# Altium project nova34.PrjPcb (part 2 of 3)

## Sheet Page09 WIFI&Bluetooth.SchDoc
size 386 x 246 mm; SheetNumber: 7; SheetTotal: 11
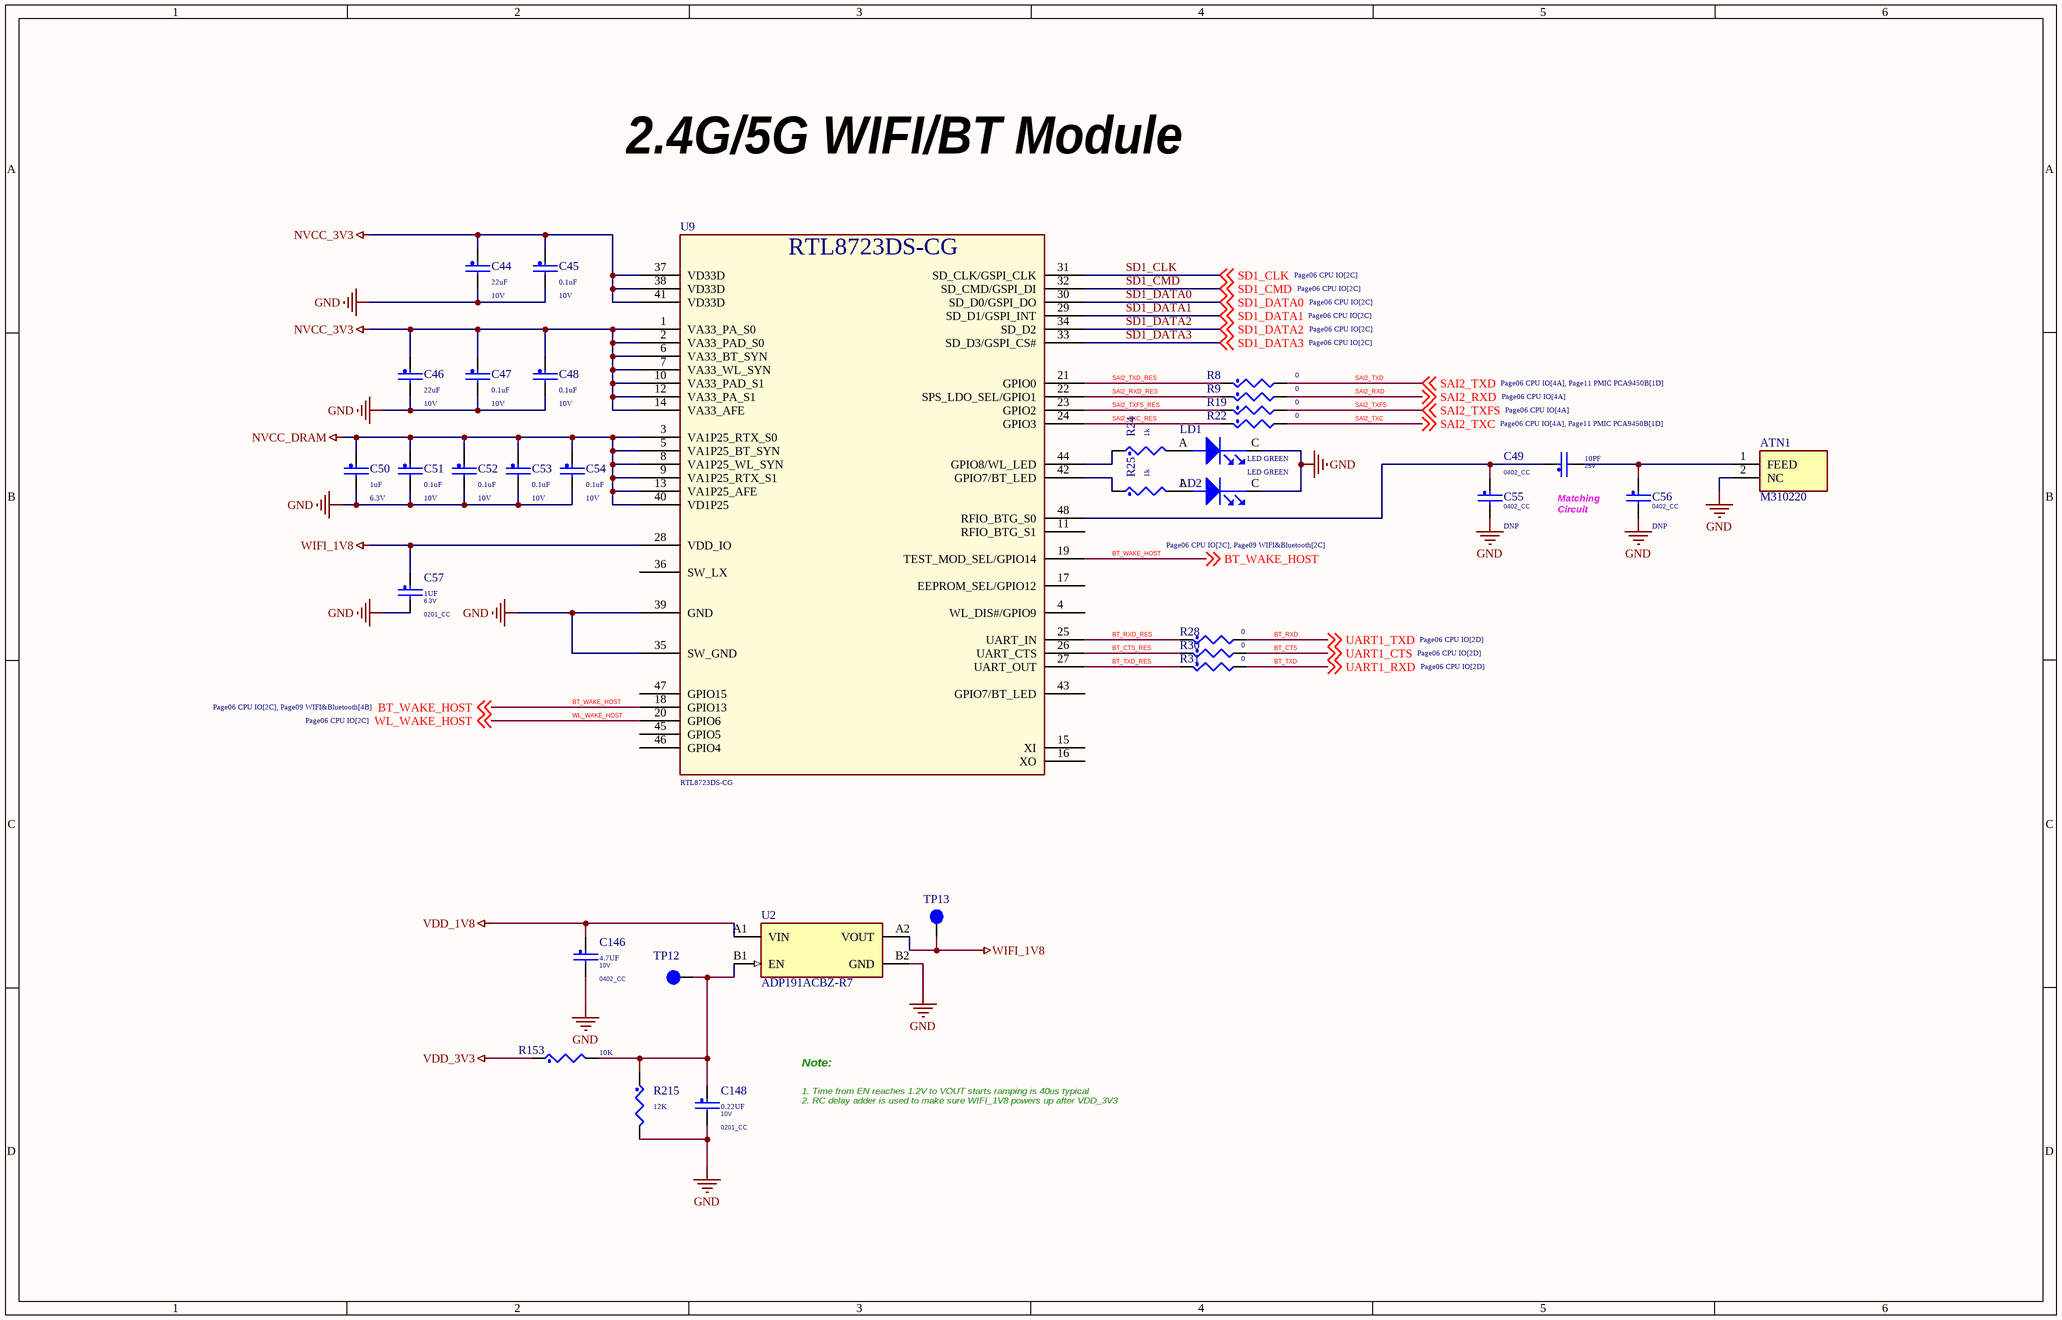
[diagram p7: Page09 WIFI&Bluetooth.SchDoc]

### Parts
ATN1  M310220  [M310220]
C44  22uF  Voltage: 10V  [0603_CC]
C45  0.1uF  Voltage: 10V  [0201_CC - C]
C46  22uF  Voltage: 10V  [0603_CC]
C47  0.1uF  Voltage: 10V  [0201_CC - C]
C48  0.1uF  Voltage: 10V  [0201_CC - C]
C49  10PF  VOLTAGE: 25V  PCB Footprint: 0402_CC  [0402_CC - C]
C50  1uF  Voltage: 6.3V  [0201_CC - C]
C51  0.1uF  Voltage: 10V  [0201_CC - C]
C52  0.1uF  Voltage: 10V  [0201_CC - C]
C53  0.1uF  Voltage: 10V  [0201_CC - C]
C54  0.1uF  Voltage: 10V  [0201_CC - C]
C55  ASSY_OPT: DNP  PCB Footprint: 0402_CC  [0402_CC - C]  (hidden comment: 10PF)
C56  ASSY_OPT: DNP  PCB Footprint: 0402_CC  [0402_CC - C]  (hidden comment: 10PF)
C57  1UF  PCB Footprint: 0201_CC  VOLTAGE: 6.3V  [0201_CC - C]
C146  4.7UF  PCB Footprint: 0402_CC  VOLTAGE: 10V  [0402_CC - C]
C148  0.22UF  VOLTAGE: 10V  PCB Footprint: 0201_CC  [0201_CC - C]
LD1  LED GREEN  [LED_0603]
LD2  LED GREEN  [LED_0603]
R8  0  [0402_CC_RES]
R9  0  [0402_CC_RES]
R19  0  [0402_CC_RES]
R22  0  [0402_CC_RES]
R24  1k  [0201_RES]
R25  1k  [0201_RES]
R28  0  [0402_CC_RES]
R30  0  [0402_CC_RES]
R31  0  [0402_CC_RES]
R153  10K  [0201_RES]
R215  12K  [0201_RES]
TP12  tpad_020  [Test Pin]  (value not drawn)
TP13  tpad_020  [Test Pin]  (value not drawn)
U2  ADP191ACBZ-R7  [FP-CB-4-3-MFG]
U9  RTL8723DS-CG  [RTL8723DS-CG]

### Nets
GND: ATN1.2(NC) C44.2 C45.2 C46.2 C47.2 C48.2 C50.2 C51.2 C52.2 C53.2 C54.2 C55.2 C56.2 C57.2 C146.2 C148.2 LD1.C(CATHODE) LD2.C(CATHODE) R215.2 U2.B2(GND) U9.35(SW_GND) U9.39(GND)
NVCC_DRAM: C50.1 C51.1 C52.1 C53.1 C54.1 U9.3(VA1P25_RTX_S0) U9.5(VA1P25_BT_SYN) U9.8(VA1P25_WL_SYN) U9.9(VA1P25_RTX_S1) U9.13(VA1P25_AFE) U9.40(VD1P25)
VDD_1V8: C146.1 U2.A1(VIN)
VDD_3V3: C44.1 C45.1 C46.1 C47.1 C48.1 R153.1 U9.1(VA33_PA_S0) U9.2(VA33_PAD_S0) U9.6(VA33_BT_SYN) U9.7(VA33_WL_SYN) U9.10(VA33_PAD_S1) U9.12(VA33_PA_S1) U9.14(VA33_AFE) U9.37(VD33D) U9.38(VD33D) U9.41(VD33D)  [also labelled NVCC_3V3]
WIFI_1V8: C57.1 TP13.1(Pin1) U2.A2(VOUT) U9.28(VDD_IO)
BT_CTS: R30.2 ; off-sheet UART1_CTS  [also labelled UART1_CTS]
BT_CTS_RES: R30.1 U9.26(UART_CTS)
BT_RXD: R28.2 ; off-sheet UART1_TXD  [also labelled UART1_TXD]
BT_RXD_RES: R28.1 U9.25(UART_IN)
BT_TXD: R31.2 ; off-sheet UART1_RXD  [also labelled UART1_RXD]
BT_TXD_RES: R31.1 U9.27(UART_OUT)
BT_WAKE_HOST: U9.18(GPIO13) U9.19(TEST_MOD_SEL/GPIO14) ; off-sheet BT_WAKE_HOST
SAI2_RXD: R9.2 ; off-sheet SAI2_RXD
SAI2_RXD_RES: R9.1 U9.22(SPS_LDO_SEL/GPIO1)
SAI2_TXC: R22.2 ; off-sheet SAI2_TXC
SAI2_TXC_RES: R22.1 U9.24(GPIO3)
SAI2_TXD: R8.2 ; off-sheet SAI2_TXD
SAI2_TXD_RES: R8.1 U9.21(GPIO0)
SAI2_TXFS: R19.2 ; off-sheet SAI2_TXFS
SAI2_TXFS_RES: R19.1 U9.23(GPIO2)
SD1_CLK: U9.31(SD_CLK/GSPI_CLK) ; off-sheet SD1_CLK
SD1_CMD: U9.32(SD_CMD/GSPI_DI) ; off-sheet SD1_CMD
SD1_DATA0: U9.30(SD_D0/GSPI_DO) ; off-sheet SD1_DATA0
SD1_DATA1: U9.29(SD_D1/GSPI_INT) ; off-sheet SD1_DATA1
SD1_DATA2: U9.34(SD_D2) ; off-sheet SD1_DATA2
SD1_DATA3: U9.33(SD_D3/GSPI_CS#) ; off-sheet SD1_DATA3
WL_WAKE_HOST: U9.20(GPIO6) ; off-sheet WL_WAKE_HOST
NetATN1_1: ATN1.1(FEED) C49.2 C56.1
NetC49_1: C49.1 C55.1 U9.48(RFIO_BTG_S0)
NetC148_1: C148.1 R153.2 R215.1 TP12.1(Pin1) U2.B1(EN)
NetLD1_A: LD1.A(ANODE) R24.2
NetLD2_A: LD2.A(ANODE) R25.2
NetR24_1: R24.1 U9.44(GPIO8/WL_LED)
NetR25_1: R25.1 U9.42(GPIO7/BT_LED)

Not connected (* = marked no-connect by the designer): U9 4(WL_DIS#/GPIO9) 11(RFIO_BTG_S1) 15(XI) 16(XO) 17(EEPROM_SEL/GPIO12) 36(SW_LX) 43(GPIO7/BT_LED) 45(GPIO5) 46(GPIO4) 47(GPIO15)

### Notes on the sheet
- 2.4G/5G WIFI/BT Module
- (near C56) Matching
  Circuit
- Note:
- 1. Time from EN reaches 1.2V to VOUT starts ramping is 40us typical
  2. RC delay adder is used to make sure WIFI_1V8 powers up after VDD_3V3

### Library data of the parts
ATN1 = M310220: Antennas Ceramic Chip ANTENNA BT/WLAN 2.4-2.5GHz; Manufacturer_Name: Kyocera AVX; Geometry.Height: 1.18mm; Farnell Part Number: *; Farnell Price/Stock: *; Manufacturer_Part_Number: M310220; Datasheet Link: *
C44-C48 C50-C54 = CAP_NP: CLASS: DISCRETE
C49 C56 = CAP_NP: CAP CER 10PF 25V 5% C0G 0402; CLASS: DISCRETE; MFG_PN01: C0402C0G250-100JNP; MFG_NAME01: VENKEL COMPANY; CAD_APPROVED: Yes; FPLIST: CC0402_25,CC0402_HD,0402_CC; AGILE_PN: 150-30134; ROHS: Yes; Tolerance: 5%; Package Type: 0402; HEIGHT: 0.635 MM; Package Size: Paper Tape (7" Reel)
  C56: VOLTAGE: 25V
C55 = CAP_NP: CAP CER 10PF 25V 5% C0G 0402; CLASS: DISCRETE; AGILE_PN: 150-30134; FPLIST: CC0402_25,CC0402_HD,0402_CC; CAD_APPROVED: Yes; MFG_NAME01: VENKEL COMPANY; MFG_PN01: C0402C0G250-100JNP; Package Size: Paper Tape (7" Reel); HEIGHT: 0.635 MM; Package Type: 0402; Tolerance: 5%; ROHS: Yes; VOLTAGE: 25V
C57 = CAP_NP: as C90 on sheet Page04 CPU PWR; Package Type: 7¡± reel; Package Size: 0201; HEIGHT: 0.35MM; ROHS: Yes; Tolerance: 20%
C146 = CAP_NP: as C260 on sheet Page04 CPU PWR; Tolerance: 10%; ROHS: Yes; HEIGHT: 0.65MM
C148 = CAP_NP: CAP CER 0.22UF 10V 20% X5R 0201; CLASS: DISCRETE; FPLIST: CC0201,CC0201_HD,0201_CC; CAD_APPROVED: Yes; MFG_PN01: LMK063BJ224MP-F; MFG_NAME01: Taiyo Yuden; AGILE_PN: 150-78815; HEIGHT: 0.33MM; ROHS: Yes; Tolerance: 20%
LD1 LD2 = LED: as D1 on sheet Page06 CPU IO; ROHS: Yes; HEIGHT: 0.8 MM; PCB Footprint: LED_0603
R8 R9 R19 R22 = RES: RES MF ZERO OHM 1/16W 5% 0402; CLASS: DISCRETE; PCB Footprint: 0402_CC; AGILE_PN: 470-75394; MFG_NAME01: YAGEO AMERICA; MFG_PN01: RC0402JR-070RL; CAD_APPROVED: Yes; FPLIST: RC0402_25,RC0402_HD,RC0402_X2,0402_CC; TOL: 1%; SIGNAL_MODEL: DEFAULT_RESISTOR_10000OHM_2_1; VOLTAGE: 1/16W; Tolerance: 5%; ROHS: Yes; HEIGHT: 0.45 MM
R24 R25 = RES: RES MF 1.0K OHM 1/20W 1% 30V -55+155C 0201; CLASS: DISCRETE; Temp Range: -55¡ãC ~ 155¡ãC; VOLTAGE: 30; FPLIST: RC0201,0201_CC; CAD_APPROVED: Yes; MFG_PN01: CRCW02011K00FNED; MFG_NAME01: VISHAY INTERTECHNOLOGY; AGILE_PN: 470-82221; PCB Footprint: 0201_CC; HEIGHT: 0.28MM; Temp_Range: -55¡ãC ~ 155¡ãC; ROHS: Yes; Tolerance: 1%
R28 R30 R31 = RES: RES MF ZERO OHM 1/16W 5% 0402; CLASS: DISCRETE; AGILE_PN: 470-75394; MFG_NAME01: YAGEO AMERICA; MFG_PN01: RC0402JR-070RL; CAD_APPROVED: Yes; FPLIST: RC0402_25,RC0402_HD,RC0402_X2,0402_CC; TOL: 1%; SIGNAL_MODEL: DEFAULT_RESISTOR_10000OHM_2_1; PCB Footprint: 0402_CC; VOLTAGE: 1/16W; Tolerance: 5%; ROHS: Yes; HEIGHT: 0.45 MM
R153 = RES: RES MF 10K 1/20W 5% 0201; CLASS: DISCRETE; FPLIST: RC0201,0201_CC; CAD_APPROVED: Yes; MFG_PN01: RTT01103JTH; MFG_NAME01: RALEC ELECTRONIC CORP; AGILE_PN: 470-79719; PCB Footprint: 0201_CC; HEIGHT: 0.26 MM; ROHS: Yes; Tolerance: 5%
R215 = RES: RES MF 12K 1/20W 1% 0201; CLASS: DISCRETE; PCB Footprint: 0201_CC; MFG_PN01: RC-0201-123FT; MFG_NAME01: SKYMOS; CAD_APPROVED: Yes; FPLIST: RC0201,0201_CC; AGILE_PN: 470-77701; VOLTAGE: 1/20W; ROHS: Yes; Tolerance: 1%; HEIGHT: 0.26MM
TP12 TP13 = TESTLOOP: TEST POINT PAD 0.5MM DIA SMT, NO PART TO ORDER; CLASS: IO; CAD_APPROVED: Yes; AGILE_PN: 211-77484; PCB Footprint: tpad_020; HEIGHT: 0.1MM; ROHS: Yes
U2 = CMP-09138-000080-1: IC PWR SWITCH P-CHAN 1:1 4WLCSP; Nominal Supply Current: 500mA; Output Configuration: High Side; Max Power Dissipation: 7.2uW; Min Input Voltage: 1.1V; Operating Supply Current: 2uA; On-State Resistance: 105mR; Max Input Voltage: 3.6V; Number of Outputs: 1; Interface: On/Off; Lead Free: Contains Lead; RoHS Compliant: Yes; Number of Pins: 4; Output Current: 500mA; Min Operating Temperature: -40°C; Mount: Surface Mount; Supply Current: 500mA; Package Quantity: 1; Radiation Hardening: No; Max Output Current: 500mA; Max Supply Current: 500mA; REACH SVHC: No SVHC; Max Operating Temperature: 85°C; Packaging: Tape and Reel; Series: -; Operating Supply Voltage: 3.6V

## Sheet Page10 BOOT_CFG.SchDoc
size 513 x 386 mm; SheetNumber: 8; SheetTotal: 11
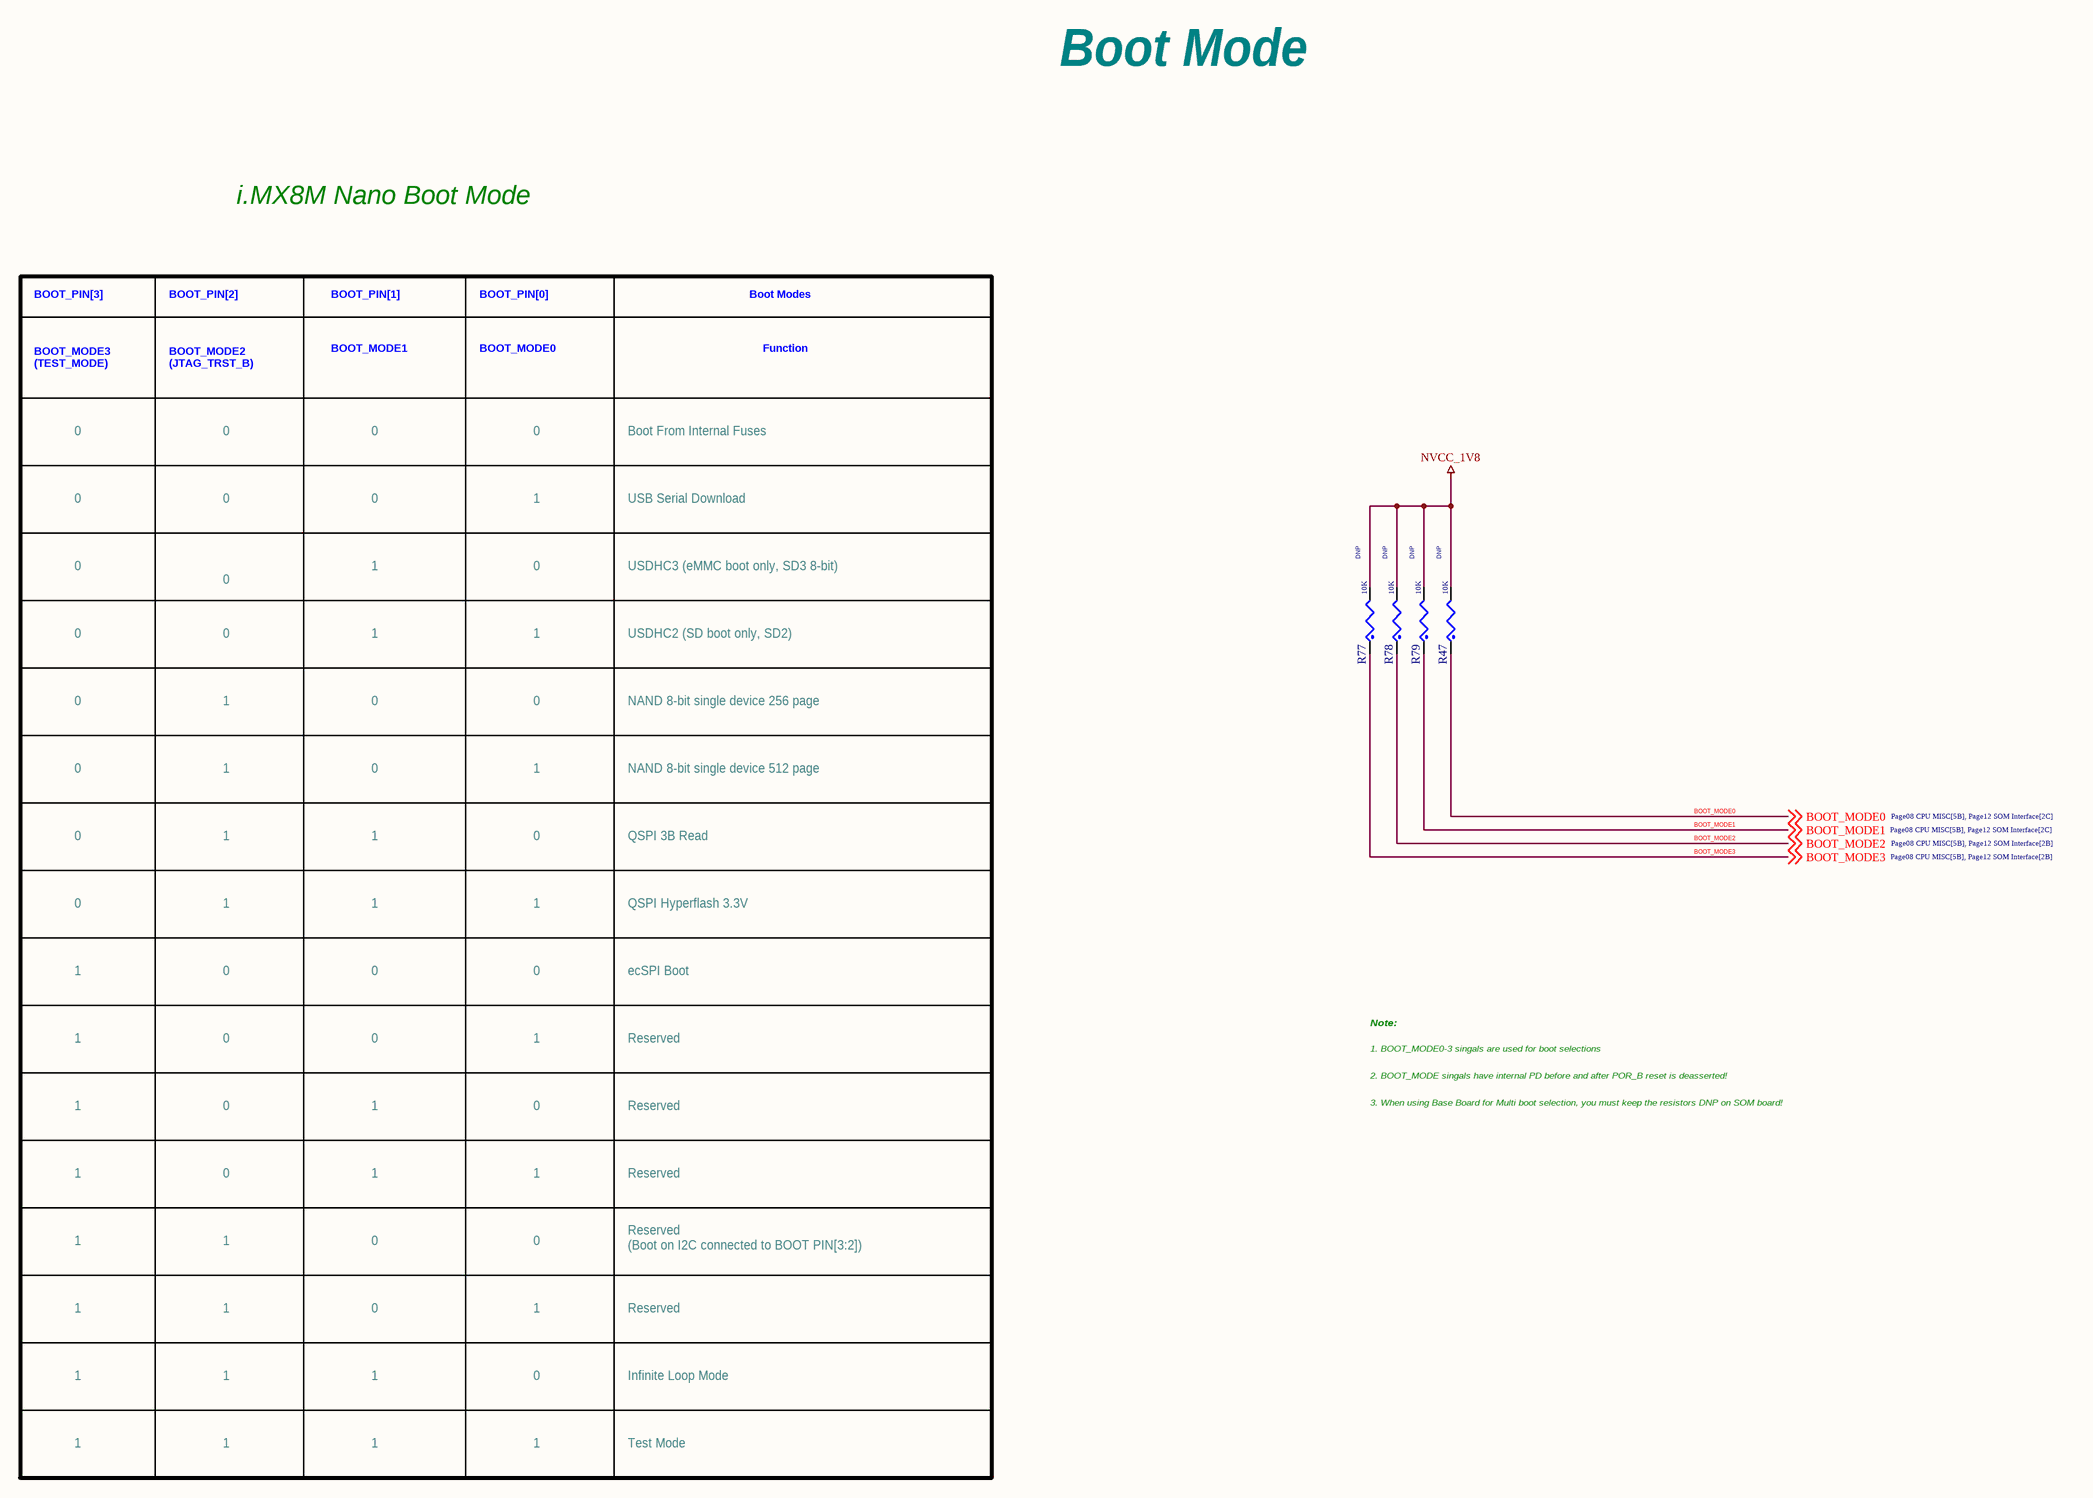
[diagram p8: Page10 BOOT_CFG.SchDoc]

### Parts
R47  10K  ASSY_OPT: DNP  [0402_CC_RES]
R77  10K  ASSY_OPT: DNP  [0402_CC_RES]
R78  10K  ASSY_OPT: DNP  [0402_CC_RES]
R79  10K  ASSY_OPT: DNP  [0402_CC_RES]

### Nets
NVCC_1V8: R47.2 R77.2 R78.2 R79.2  [project net VDD_1V8]
BOOT_MODE0: R47.1 ; off-sheet BOOT_MODE0
BOOT_MODE1: R79.1 ; off-sheet BOOT_MODE1
BOOT_MODE2: R78.1 ; off-sheet BOOT_MODE2
BOOT_MODE3: R77.1 ; off-sheet BOOT_MODE3

### Notes on the sheet
- Boot Mode
- i.MX8M Nano Boot Mode
- BOOT_PIN[3]
- BOOT_PIN[2]
- BOOT_PIN[1]
- BOOT_PIN[0]
- Boot Modes
- BOOT_MODE1
- BOOT_MODE0
- Function
- BOOT_MODE3
  (TEST_MODE)
- 0
- BOOT_MODE2
  (JTAG_TRST_B)
- Boot From Internal Fuses
- 1
- USB Serial Download
- USDHC3 (eMMC boot only, SD3 8-bit)
- USDHC2 (SD boot only, SD2)
- NAND 8-bit single device 256 page
- NAND 8-bit single device 512 page
- QSPI 3B Read
- QSPI Hyperflash 3.3V
- ecSPI Boot
- Reserved
- Note:
- 3. When using Base Board for Multi boot selection, you must keep the resistors DNP on SOM board!
- 2. BOOT_MODE singals have internal PD before and after POR_B reset is deasserted!
- 1. BOOT_MODE0-3 singals are used for boot selections
- Reserved
  (Boot on I2C connected to BOOT PIN[3:2])
- Infinite Loop Mode
- Test Mode

### Library data of the parts
R47 R77 = RES: RES MF 10K 1/16W 5% 0402; CLASS: DISCRETE; PCB Footprint: 0402_CC; AGILE_PN: 470-75557; MFG_NAME01: VISHAY INTERTECHNOLOGY; MFG_PN01: CRCW040210K0JNED; CAD_APPROVED: Yes; FPLIST: RC0402_25,RC0402_HD,0402_CC; HEIGHT: 0.4 MM; TOL: 5%; Tolerance: 5%; ROHS: Yes
R78 R79 = RES: RES MF 10K 1/16W 5% 0402; CLASS: DISCRETE; PCB Footprint: 0402_CC; FPLIST: RC0402_25,RC0402_HD,0402_CC; CAD_APPROVED: Yes; MFG_PN01: CRCW040210K0JNED; MFG_NAME01: VISHAY INTERTECHNOLOGY; AGILE_PN: 470-75557; ROHS: Yes; Tolerance: 5%; TOL: 5%; HEIGHT: 0.4 MM

## Sheet Page11 PMIC PCA9450B.SchDoc
size 568 x 386 mm; SheetNumber: 9; SheetTotal: 11
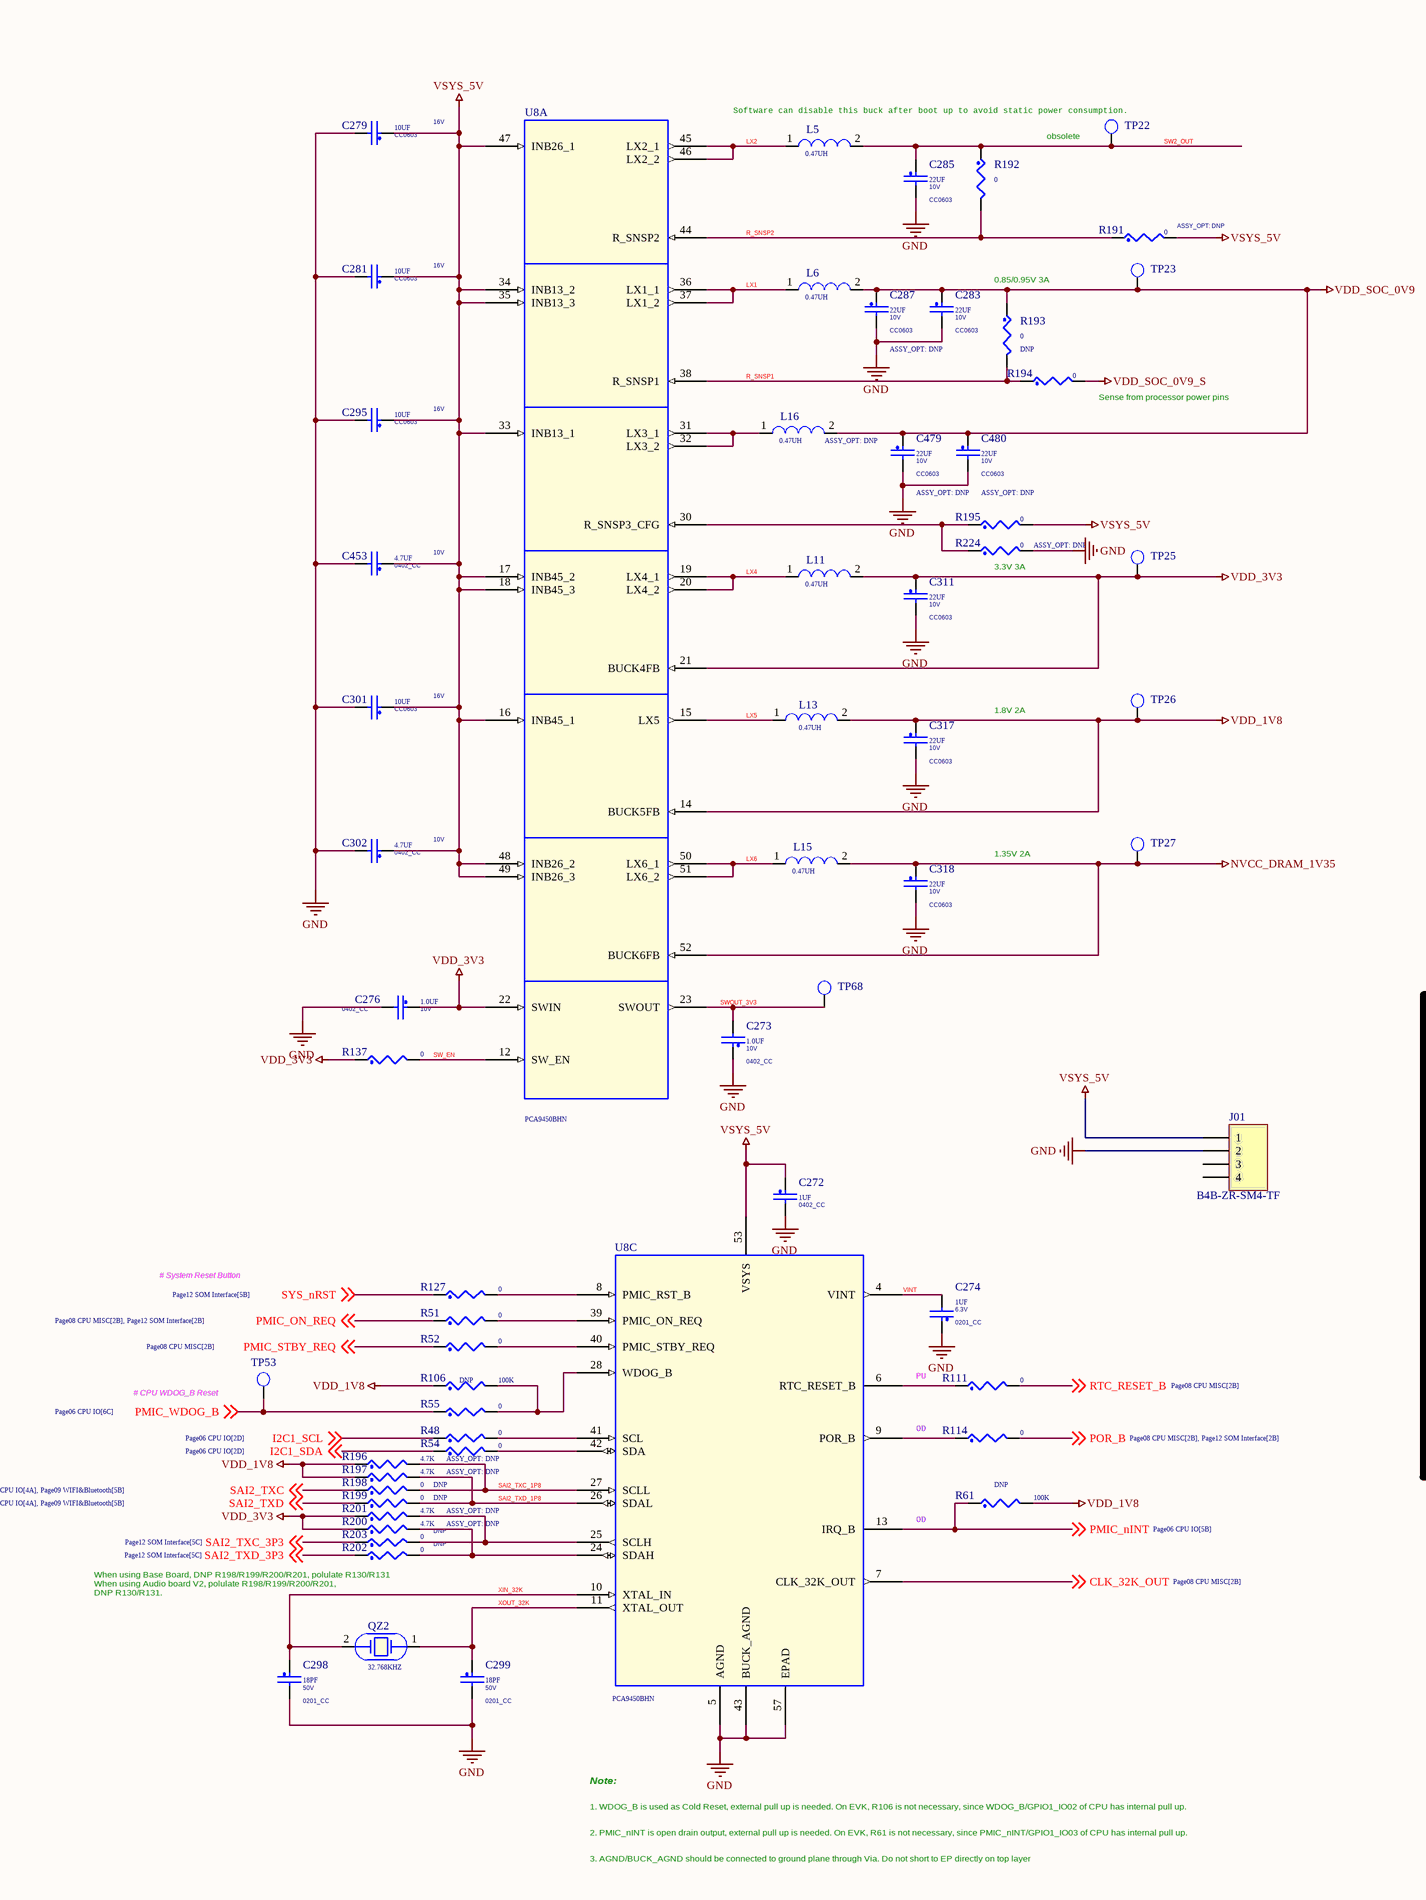
[diagram p9: Page11 PMIC PCA9450B.SchDoc, left]
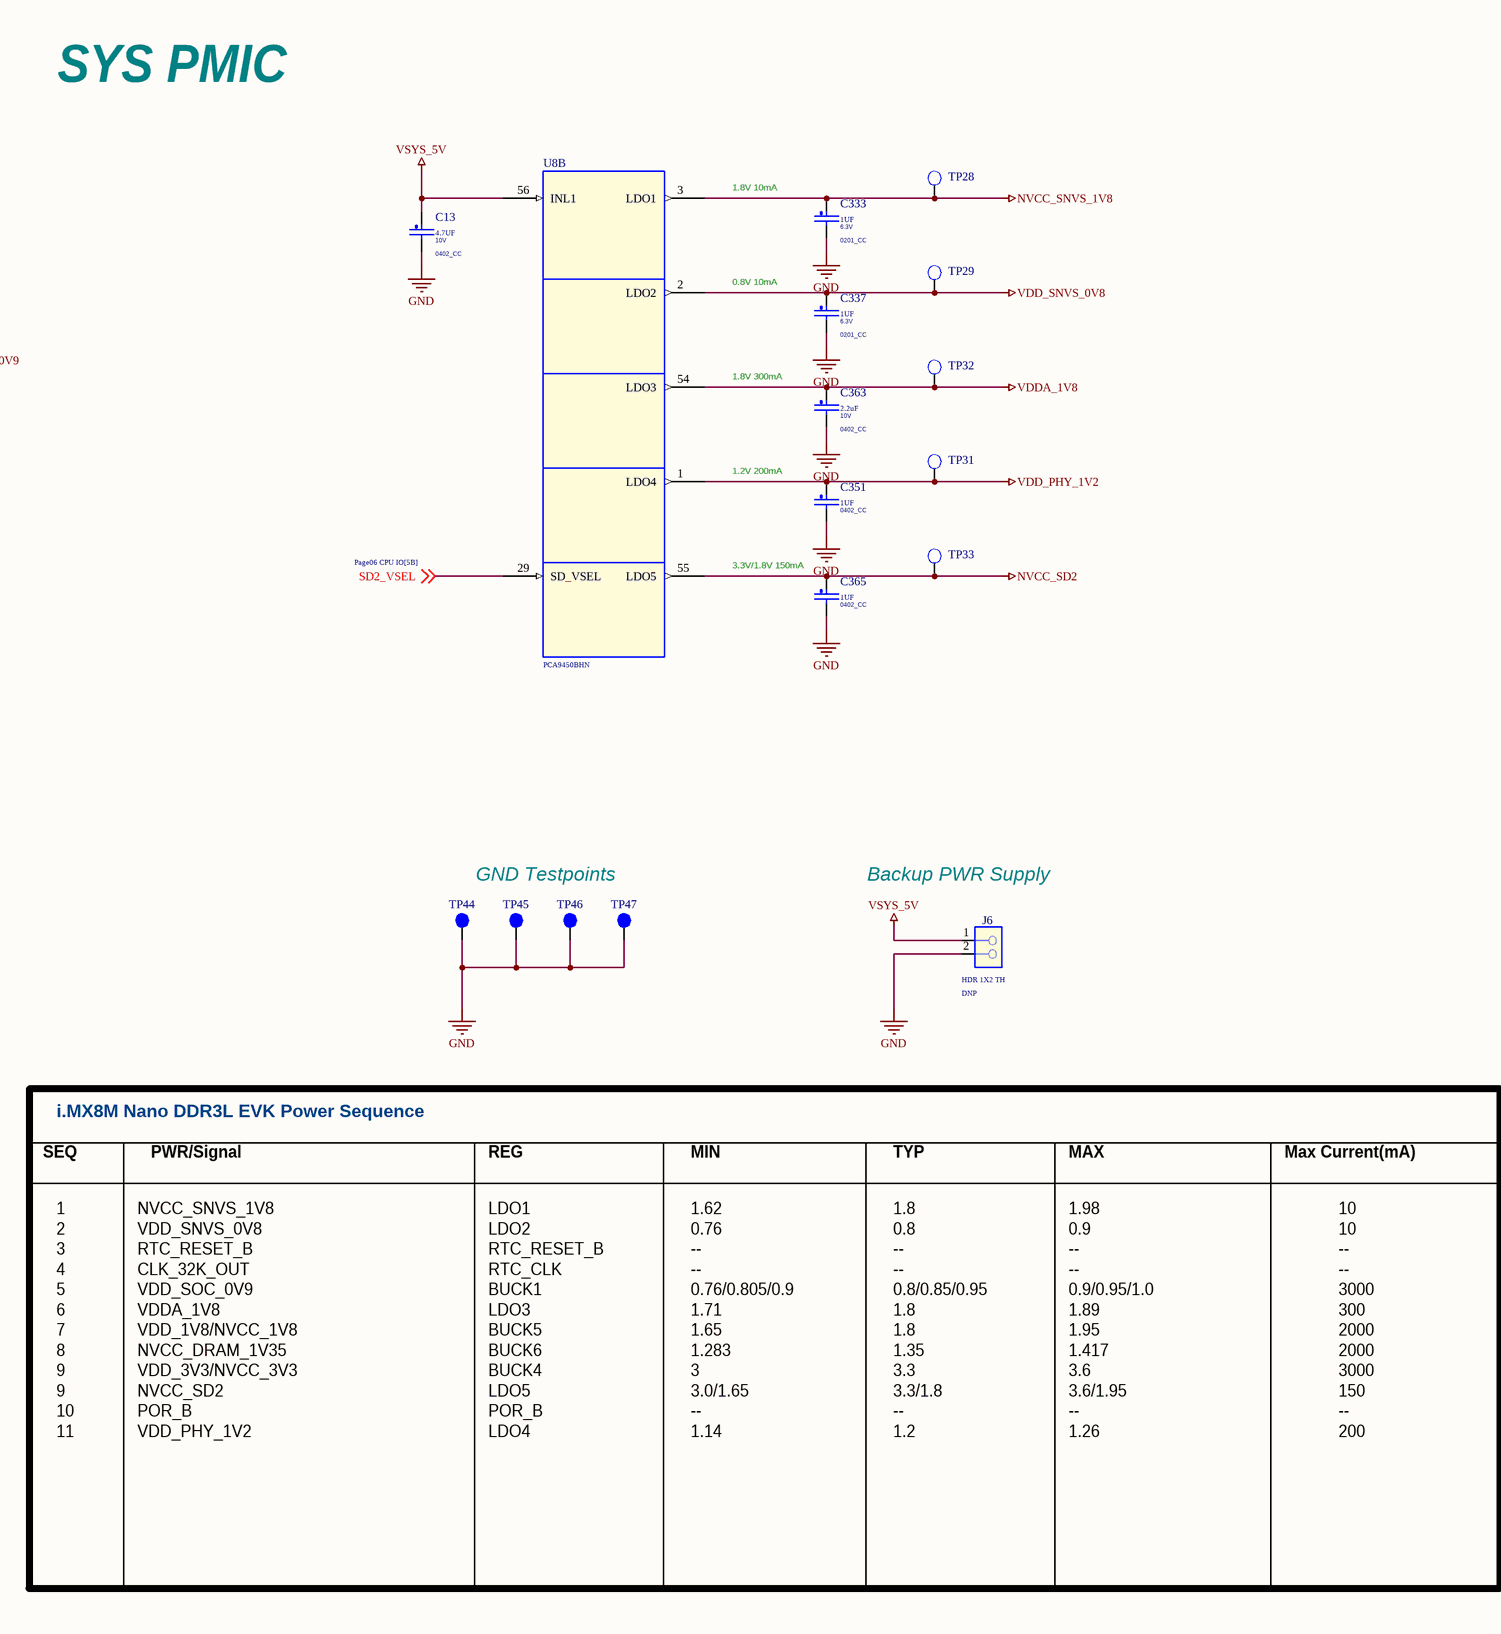
[diagram p10: Page11 PMIC PCA9450B.SchDoc, right]

### Parts
C13  4.7UF  VOLTAGE: 10V  PCB Footprint: 0402_CC  [0402_CC - C]
C272  1UF  PCB Footprint: 0402_CC  [0402_CC - C]
C273  1.0UF  PCB Footprint: 0402_CC  VOLTAGE: 10V  [0402_CC - C]
C274  1UF  VOLTAGE: 6.3V  PCB Footprint: 0201_CC  [0201_CC - C]
C276  1.0UF  PCB Footprint: 0402_CC  VOLTAGE: 10V  [0402_CC - C]
C279  10UF  VOLTAGE: 16V  PCB Footprint: CC0603  [0603_CC]
C281  10UF  VOLTAGE: 16V  PCB Footprint: CC0603  [0603_CC]
C283  22UF  VOLTAGE: 10V  PCB Footprint: CC0603  [0603_CC]
C285  22UF  PCB Footprint: CC0603  VOLTAGE: 10V  [0603_CC]
C287  22UF  ASSY_OPT: DNP  VOLTAGE: 10V  PCB Footprint: CC0603  [0603_CC]
C295  10UF  VOLTAGE: 16V  PCB Footprint: CC0603  [0603_CC]
C298  18PF  VOLTAGE: 50V  PCB Footprint: 0201_CC  [0201_CC - C]
C299  18PF  VOLTAGE: 50V  PCB Footprint: 0201_CC  [0201_CC - C]
C301  10UF  VOLTAGE: 16V  PCB Footprint: CC0603  [0603_CC]
C302  4.7UF  PCB Footprint: 0402_CC  VOLTAGE: 10V  [0402_CC - C]
C311  22UF  VOLTAGE: 10V  PCB Footprint: CC0603  [0603_CC]
C317  22UF  VOLTAGE: 10V  PCB Footprint: CC0603  [0603_CC]
C318  22UF  VOLTAGE: 10V  PCB Footprint: CC0603  [0603_CC]
C333  1UF  VOLTAGE: 6.3V  PCB Footprint: 0201_CC  [0201_CC - C]
C337  1UF  VOLTAGE: 6.3V  PCB Footprint: 0201_CC  [0201_CC - C]
C351  1UF  PCB Footprint: 0402_CC  [0402_CC - C]
C363  2.2uF  VOLTAGE: 10V  PCB Footprint: 0402_CC  [0402_CC - C]
C365  1UF  PCB Footprint: 0402_CC  [0402_CC - C]
C453  4.7UF  PCB Footprint: 0402_CC  VOLTAGE: 10V  [0402_CC - C]
C479  22UF  ASSY_OPT: DNP  VOLTAGE: 10V  PCB Footprint: CC0603  [0603_CC]
C480  22UF  ASSY_OPT: DNP  VOLTAGE: 10V  PCB Footprint: CC0603  [0603_CC]
J01  B4B-ZR-SM4-TF  [JST_B4B-ZR-SM4-TFT(LF)(SN)]
J6  HDR 1X2 TH  ASSY_OPT: DNP  [HDR_1X2]
L5  0.47UH  [ind_sph2520]
L6  0.47UH  [ind_sph2520]
L11  0.47UH  [ind_sph2520]
L13  0.47UH  [IND_SPH2520]
L15  0.47UH  [ind_sph2520]
L16  0.47UH  ASSY_OPT: DNP  [ind_sph2520]
QZ2  32.768KHZ  [XTAL_ABS07-32.768KHZ-T - duplicate]
R48  0  [0402_CC_RES]
R51  0  [0402_CC_RES]
R52  0  [0402_CC_RES]
R54  0  [0402_CC_RES]
R55  0  [0402_CC_RES]
R61  100K  ASSY_OPT: DNP  [0201_RES]
R106  100K  ASSY_OPT: DNP  [0201_RES]
R111  0  [0402_CC_RES]
R114  0  [0402_CC_RES]
R127  0  [0402_CC_RES]
R137  0  [0402_CC_RES]
R191  0  ASSY_OPT: DNP  [0402_CC_RES]
R192  0  [0402_CC_RES]
R193  0  ASSY_OPT: DNP  [0402_CC_RES]
R194  0  [0402_CC_RES]
R195  0  [0402_CC_RES]
R196  4.7K  ASSY_OPT: DNP  [0201_RES]
R197  4.7K  ASSY_OPT: DNP  [0201_RES]
R198  0  ASSY_OPT: DNP  [0402_CC_RES]
R199  0  ASSY_OPT: DNP  [0402_CC_RES]
R200  4.7K  ASSY_OPT: DNP  [0201_RES]
R201  4.7K  ASSY_OPT: DNP  [0201_RES]
R202  0  ASSY_OPT: DNP  [0402_CC_RES]
R203  0  ASSY_OPT: DNP  [0402_CC_RES]
R224  0  ASSY_OPT: DNP  [0402_CC_RES]
TP22  TP_35MIL  [Test Pin]  (value not drawn)  (graphical)
TP23  TP_35MIL  [Test Pin]  (value not drawn)
TP25  TP_35MIL  [Test Pin]  (value not drawn)
TP26  TP_35MIL  [Test Pin]  (value not drawn)
TP27  TP_35MIL  [Test Pin]  (value not drawn)
TP28  TP_35MIL  [Test Pin]  (value not drawn)  (graphical)
TP29  TP_35MIL  [Test Pin]  (value not drawn)  (graphical)
TP31  TP_35MIL  [Test Pin]  (value not drawn)  (graphical)
TP32  TP_35MIL  [Test Pin]  (value not drawn)  (graphical)
TP33  TP_35MIL  [Test Pin]  (value not drawn)  (graphical)
TP44  TPAD_050  [Test Pin]  (value not drawn)  (graphical)
TP45  TPAD_050  [Test Pin]  (value not drawn)  (graphical)
TP46  TPAD_050  [Test Pin]  (value not drawn)  (graphical)
TP47  TPAD_050  [Test Pin]  (value not drawn)  (graphical)
TP53  TP_35MIL  [Test Pin]  (value not drawn)  (graphical)
TP68  TP_35MIL  [Test Pin]  (value not drawn)
U8  PCA9450BHN  [QFN40P700X700X100-57N-D]  (parts A,B,C of 3)

### Nets
GND: C13.2 C272.2 C273.1 C274.1 C276.2 C279.2 C281.2 C283.2 C285.2 C287.2 C295.2 C298.2 C299.2 C301.2 C302.2 C311.2 C317.2 C318.2 C333.2 C337.2 C351.2 C363.2 C365.2 C453.2 C479.2 C480.2 J01.2 J6.2 R224.2 TP44.1(Pin1) TP45.1(Pin1) TP46.1(Pin1) TP47.1(Pin1) U8.5(AGND) U8.43(BUCK_AGND) U8.57(EPAD)
NVCC_DRAM_1V35: C318.1 L15.2 TP27.1(TP) U8.52(BUCK6FB)
NVCC_SD2: C365.1 TP33.1(TP) U8.55(LDO5)
NVCC_SNVS_1V8: C333.1 TP28.1(TP) U8.3(LDO1)
VDD_1V8: C317.1 L13.2 R61.2 R106.1 R196.1 R197.1 TP26.1(TP) U8.14(BUCK5FB)
VDD_3V3: C276.1 C311.1 L11.2 R137.1 R200.1 R201.1 TP25.1(TP) U8.21(BUCK4FB) U8.22(SWIN)
VDD_PHY_1V2: C351.1 TP31.1(TP) U8.1(LDO4)
VDD_SNVS_0V8: C337.1 TP29.1(TP) U8.2(LDO2)
VDD_SOC_0V9: C283.1 C287.1 C479.1 C480.1 L6.2 L16.2 R193.1 R194.2 TP23.1(TP)  [also labelled VDD_SOC_0V9_S]
VDDA_1V8: C363.1 TP32.1(TP) U8.54(LDO3)
VSYS_5V: C13.1 C272.1 C279.1 C281.1 C295.1 C301.1 C302.1 C453.1 J01.1 J6.1 R191.2 R195.2 U8.16(INB45_1) U8.17(INB45_2) U8.18(INB45_3) U8.33(INB13_1) U8.34(INB13_2) U8.35(INB13_3) U8.47(INB26_1) U8.48(INB26_2) U8.49(INB26_3) U8.53(VSYS) U8.56(INL1)
CLK_32K_OUT: U8.7(CLK_32K_OUT) ; off-sheet CLK_32K_OUT
I2C1_SCL: R48.1 ; off-sheet I2C1_SCL
I2C1_SDA: R54.1 ; off-sheet I2C1_SDA
LX1: L6.1 U8.36(LX1_1) U8.37(LX1_2)
LX2: L5.1 U8.45(LX2_1) U8.46(LX2_2)
LX4: L11.1 U8.19(LX4_1) U8.20(LX4_2)
LX5: L13.1 U8.15(LX5)
LX6: L15.1 U8.50(LX6_1) U8.51(LX6_2)
PMIC_nINT: R61.1 U8.13(IRQ_B) ; off-sheet PMIC_nINT
PMIC_ON_REQ: R51.1 ; off-sheet PMIC_ON_REQ
PMIC_STBY_REQ: R52.1 ; off-sheet PMIC_STBY_REQ
PMIC_WDOG_B: R55.1 TP53.1(TP) ; off-sheet PMIC_WDOG_B
POR_B: R114.2 ; off-sheet POR_B
R_SNSP1: R193.2 R194.1 U8.38(R_SNSP1)
R_SNSP2: R191.1 R192.2 U8.44(R_SNSP2)
RTC_RESET_B: R111.2 ; off-sheet RTC_RESET_B
SAI2_TXC: R198.1 ; off-sheet SAI2_TXC
SAI2_TXC_1P8: R196.2 R198.2 U8.27(SCLL)
SAI2_TXC_3P3: R203.1 ; off-sheet SAI2_TXC_3P3
SAI2_TXD: R199.1 ; off-sheet SAI2_TXD
SAI2_TXD_1P8: R197.2 R199.2 U8.26(SDAL)
SAI2_TXD_3P3: R202.1 ; off-sheet SAI2_TXD_3P3
SD2_VSEL: U8.29(SD_VSEL) ; off-sheet SD2_VSEL
SW2_OUT: C285.1 L5.2 R192.1 TP22.1(TP)
SW_EN: R137.2 U8.12(SW_EN)
SWOUT_3V3: C273.2 TP68.1(TP) U8.23(SWOUT)
SYS_nRST: R127.1 ; off-sheet SYS_nRST
VINT: C274.2 U8.4(VINT)
XIN_32K: C298.1 QZ2.2 U8.10(XTAL_IN)
XOUT_32K: C299.1 QZ2.1 U8.11(XTAL_OUT)
NetL16_1: L16.1 U8.31(LX3_1) U8.32(LX3_2)
NetR48_2: R48.2 U8.41(SCL)
NetR51_2: R51.2 U8.39(PMIC_ON_REQ)
NetR52_2: R52.2 U8.40(PMIC_STBY_REQ)
NetR54_2: R54.2 U8.42(SDA)
NetR55_2: R55.2 R106.2 U8.28(WDOG_B)
NetR111_1: R111.1 U8.6(RTC_RESET_B)
NetR114_1: R114.1 U8.9(POR_B)
NetR127_2: R127.2 U8.8(PMIC_RST_B)
NetR195_1: R195.1 R224.1 U8.30(R_SNSP3_CFG)
NetR200_2: R200.2 R202.2 U8.24(SDAH)
NetR201_2: R201.2 R203.2 U8.25(SCLH)

Not connected (* = marked no-connect by the designer): J01 3 4

### Notes on the sheet
- SYS PMIC
- Software can disable this buck after boot up to avoid static power consumption.
- (near TP22) obsolete
- 1.8V 10mA
- 0.8V 10mA
- (near R193) 0.85/0.95V 3A
- 1.8V 300mA
- (near R194) Sense from processor power pins
- 1.2V 200mA
- (near C365) 3.3V/1.8V 150mA
- (near R224) 3.3V 3A
- 1.8V 2A
- GND Testpoints
- Backup PWR Supply
- 1.35V 2A
- i.MX8M Nano DDR3L EVK Power Sequence
- SEQ
- PWR/Signal
- REG
- MIN
- TYP
- MAX
- Max Current(mA)
- # System Reset Button
- # CPU WDOG_B Reset
- PU
- OD
- 1
  2
  3
  4
  5
  6
  7
  8
  9
  9
  10
  11
- NVCC_SNVS_1V8
  VDD_SNVS_0V8
  RTC_RESET_B
  CLK_32K_OUT
  VDD_SOC_0V9
  VDDA_1V8
  VDD_1V8/NVCC_1V8
  NVCC_DRAM_1V35
  VDD_3V3/NVCC_3V3
  NVCC_SD2
  POR_B
  VDD_PHY_1V2
- LDO1
  LDO2
  RTC_RESET_B
  RTC_CLK
  BUCK1
  LDO3
  BUCK5
  BUCK6
  BUCK4
  LDO5
  POR_B
  LDO4
- 1.62
  0.76
  --
  --
  0.76/0.805/0.9
  1.71
  1.65
  1.283
  3
  3.0/1.65
  --
  1.14
- 1.8
  0.8
  --
  --
  0.8/0.85/0.95
  1.8
  1.8
  1.35
  3.3
  3.3/1.8
  --
  1.2
- 1.98
  0.9
  --
  --
  0.9/0.95/1.0
  1.89
  1.95
  1.417
  3.6
  3.6/1.95
  --
  1.26
- 10
  10
  --
  --
  3000
  300
  2000
  2000
  3000
  150
  --
  200
- When using Base Board, DNP R198/R199/R200/R201, polulate R130/R131
  When using Audio board V2, polulate R198/R199/R200/R201,
  DNP R130/R131.
- Note:
- 1. WDOG_B is used as Cold Reset, external pull up is needed. On EVK, R106 is not necessary, since WDOG_B/GPIO1_IO02 of CPU has internal pull up.
- 2. PMIC_nINT is open drain output, external pull up is needed. On EVK, R61 is not necessary, since PMIC_nINT/GPIO1_IO03 of CPU has internal pull up.
- 3. AGND/BUCK_AGND should be connected to ground plane through Via. Do not short to EP directly on top layer

### Library data of the parts
C13 C453 = CAP_NP: CAP CER 4.7uF 10V 10% X5R 0402; CLASS: DISCRETE; FPLIST: CC0402_25,CC0402_HD,0402_CC; CAD_APPROVED: Yes; MFG_PN01: CL05A475KP5NRNC; MFG_NAME01: Samsung Electro Mechanics; AGILE_PN: 150-80044; HEIGHT: 0.65MM; ROHS: Yes; Tolerance: 10%
C272 C365 = CAP_NP: CAP CER 1uF 10V 10% X7S 0402; CLASS: DISCRETE; VOLTAGE: 10; FPLIST: CC0402_25,CC0402_HD,0402_CC; CAD_APPROVED: Yes; MFG_PN01: GRM155C71A105KE11D; MFG_NAME01: MURATA; AGILE_PN: 150-80357; Temp_Range: -55C - 125C; HEIGHT: 0.6MM; ROHS: Yes; Tolerance: 10%; Package Size: 0402; Temp Range: -55C - 125C
C273 = CAP_NP: CAP CER 1.0UF 10V 10% X5R 0402; CLASS: DISCRETE; FPLIST: CC0402_25,CC0402_HD,0402_CC; CAD_APPROVED: Yes; MFG_PN01: CC0402KRX5R6BB105; MFG_NAME01: YAGEO AMERICA; AGILE_PN: 150-75772; HEIGHT: 0.6MM; ROHS: Yes; Package Size: 0402
C274 = CAP_NP: CAP CER 1uF 6.3V 20% X5R 0201; CLASS: DISCRETE; AGILE_PN: 150-79407; MFG_NAME01: AVX; MFG_PN01: 02016D105MAT2A; CAD_APPROVED: Yes; FPLIST: CC0201,CC0201_HD,0201_CC,0201_CC_012SM_NSP; Tolerance: 20%; ROHS: Yes; HEIGHT: 0.35MM; Package Size: 0201; Package Type: 7¡± reel
C276 = CAP_NP: CAP CER 1.0UF 10V 10% X5R 0402; CLASS: DISCRETE; AGILE_PN: 150-75772; MFG_NAME01: YAGEO AMERICA; MFG_PN01: CC0402KRX5R6BB105; CAD_APPROVED: Yes; FPLIST: CC0402_25,CC0402_HD,0402_CC; ROHS: Yes; HEIGHT: 0.6MM; Package Size: 0402
C279 C281 = CAP_NP: CAP CER 10.0uF 16V 10% X5R 0603; CLASS: DISCRETE; FPLIST: CC0603_OV,CC0603,0603_CC,cc0603_0805_nsp; CAD_APPROVED: Yes; Temp_Range: -55¡ãC to +85¡ãC; MFG_PN01: GRM188R61C106KAALD; MFG_NAME01: MURATA; AGILE_PN: 150-80060; HEIGHT: 0.9MM; ROHS: Yes; Tolerance: 10%; Package Size: 0603; Package Type: SMT; Temp Range: -55¡ãC to +85¡ãC
C283 = CAP_NP: CAP CER 22uF 10V 20% X5R 0603; CLASS: DISCRETE; WVDC: 6.3V; AGILE_PN: 150-79530; MFG_NAME01: TDK; MFG_PN01: C1608X5R1A226M080AC; CAD_APPROVED: Yes; FPLIST: CC0603_OV,CC0603,0603_CC; SIGNAL_MODEL: DEFAULT_CAPACITOR_2.2e+07pF_2_1; Package Size: 0603; Tolerance: 20%; ROHS: Yes; HEIGHT: 1MM
C285 C287 C311 C317 C318 = CAP_NP: CAP CER 22uF 10V 20% X5R 0603; CLASS: DISCRETE; FPLIST: CC0603_OV,CC0603,0603_CC; CAD_APPROVED: Yes; MFG_PN01: C1608X5R1A226M080AC; MFG_NAME01: TDK; AGILE_PN: 150-79530; WVDC: 6.3V; SIGNAL_MODEL: DEFAULT_CAPACITOR_2.2e+07pF_2_1; HEIGHT: 1MM; ROHS: Yes; Tolerance: 20%; Package Size: 0603
C295 C301 = CAP_NP: CAP CER 10.0uF 16V 10% X5R 0603; CLASS: DISCRETE; AGILE_PN: 150-80060; MFG_NAME01: MURATA; MFG_PN01: GRM188R61C106KAALD; Temp_Range: -55¡ãC to +85¡ãC; CAD_APPROVED: Yes; FPLIST: CC0603_OV,CC0603,0603_CC,cc0603_0805_nsp; Tolerance: 10%; ROHS: Yes; HEIGHT: 0.9MM; Package Size: 0603; Package Type: SMT; Temp Range: -55¡ãC to +85¡ãC
C298 = CAP_NP: CAP CER 18pF 50V 5% C0G 0201; CLASS: DISCRETE; FPLIST: CC0201,CC0201_HD,0201_CC; CAD_APPROVED: Yes; MFG_PN01: GRM0335C1H180JA01D; MFG_NAME01: MURATA; AGILE_PN: 150-79476; HEIGHT: 0.33MM; ROHS: Yes; Tolerance: 5%; Package Size: 0201; Package Type: &#966;180mm Paper taping
C299 = CAP_NP: CAP CER 18pF 50V 5% C0G 0201; CLASS: DISCRETE; AGILE_PN: 150-79476; MFG_NAME01: MURATA; MFG_PN01: GRM0335C1H180JA01D; CAD_APPROVED: Yes; FPLIST: CC0201,CC0201_HD,0201_CC; Tolerance: 5%; ROHS: Yes; HEIGHT: 0.33MM; Package Size: 0201; Package Type: &#966;180mm Paper taping
C302 = CAP_NP: CAP CER 4.7uF 10V 10% X5R 0402; CLASS: DISCRETE; AGILE_PN: 150-80044; MFG_NAME01: Samsung Electro Mechanics; MFG_PN01: CL05A475KP5NRNC; CAD_APPROVED: Yes; FPLIST: CC0402_25,CC0402_HD,0402_CC; Tolerance: 10%; ROHS: Yes; HEIGHT: 0.65MM
C333 C337 = CAP_NP: CAP CER 1uF 6.3V 20% X5R 0201; CLASS: DISCRETE; FPLIST: CC0201,CC0201_HD,0201_CC,0201_CC_012SM_NSP; CAD_APPROVED: Yes; MFG_PN01: 02016D105MAT2A; MFG_NAME01: AVX; AGILE_PN: 150-79407; HEIGHT: 0.35MM; ROHS: Yes; Tolerance: 20%; Package Size: 0201; Package Type: 7¡± reel
C351 = CAP_NP: CAP CER 1uF 10V 10% X7S 0402; CLASS: DISCRETE; Temp_Range: -55C - 125C; AGILE_PN: 150-80357; MFG_NAME01: MURATA; MFG_PN01: GRM155C71A105KE11D; CAD_APPROVED: Yes; FPLIST: CC0402_25,CC0402_HD,0402_CC; VOLTAGE: 10; Tolerance: 10%; ROHS: Yes; HEIGHT: 0.6MM; Package Size: 0402; Temp Range: -55C - 125C
C363 = CAP_NP: CAP CER 2.2uF 10V 10% X5R 0402; CLASS: DISCRETE; AGILE_PN: 150-78974; MFG_NAME01: TDK; MFG_PN01: C1005X5R1A225K; CAD_APPROVED: Yes; FPLIST: CC0402_25,CC0402_HD,0402_CC; Tolerance: 10%; ROHS: Yes; HEIGHT: 0.55 MM; Package Size: 0402
C479 = CAP_NP: CAP CER 22uF 10V 20% X5R 0603; CLASS: DISCRETE; SIGNAL_MODEL: DEFAULT_CAPACITOR_2.2e+07pF_2_1; WVDC: 6.3V; AGILE_PN: 150-79530; MFG_NAME01: TDK; MFG_PN01: C1608X5R1A226M080AC; CAD_APPROVED: Yes; FPLIST: CC0603_OV,CC0603,0603_CC; Tolerance: 20%; ROHS: Yes; HEIGHT: 1MM; Package Size: 0603
C480 = CAP_NP: CAP CER 22uF 10V 20% X5R 0603; CLASS: DISCRETE; SIGNAL_MODEL: DEFAULT_CAPACITOR_2.2e+07pF_2_1; FPLIST: CC0603_OV,CC0603,0603_CC; CAD_APPROVED: Yes; MFG_PN01: C1608X5R1A226M080AC; MFG_NAME01: TDK; AGILE_PN: 150-79530; WVDC: 6.3V; HEIGHT: 1MM; ROHS: Yes; Tolerance: 20%; Package Size: 0603
J01 = Header 4: LatestRevisionDate: 17-Jul-2002; LatestRevisionNote: Re-released for DXP Platform.; Publisher: Altium Limited
J6 = CONN_HDR_2X1: HDR 1X2 TH 100MIL SP 339H AU 98L; CLASS: IO; FPLIST: HDR102,SH_HDR102_BOTTOM; CAD_APPROVED: YES; Temp_Range: -55¡ãC to +125¡ãC; MFG_PN01: TSW-102-07-G-S; MFG_NAME01: SAMTEC; AGILE_PN: 210-75439; PCB Footprint: HDR_1X2; HEIGHT: 8.71 MM; ROHS: Yes; Temp Range: -55¡ãC to +125¡ãC
L5 L16 = INDUCTOR: IND PWR 0.47uH@1MHZ 4.7A 20% SMT; PART_TYPE: INDUCTOR\POWER; CLASS: DISCRETE; Temp Range: -40¡ãC to +125¡ãC; CAD_APPROVED: Yes; MFG_PN01: WPN252012ER47MT; MFG_NAME01: SHENZHEN SUNLORD ELECTRONICS CO., LTD; AGILE_PN: 180-78647; PCB Footprint: ind_sph2520; Tolerance: 20%; HEIGHT: 1.2MM; Temp_Range: -40¡ãC to +125¡ãC; ROHS: Yes; TOL: 20%
L6 L15 = INDUCTOR: IND PWR 0.47uH@1MHZ 4.7A 20% SMT; PART_TYPE: INDUCTOR\POWER; CLASS: DISCRETE; AGILE_PN: 180-78647; MFG_NAME01: SHENZHEN SUNLORD ELECTRONICS CO., LTD; MFG_PN01: WPN252012ER47MT; Temp_Range: -40¡ãC to +125¡ãC; CAD_APPROVED: Yes; Tolerance: 20%; TOL: 20%; ROHS: Yes; HEIGHT: 1.2MM; PCB Footprint: ind_sph2520; Temp Range: -40¡ãC to +125¡ãC
L11 = INDUCTOR: IND PWR 0.47uH@1MHZ 4.7A 20% SMT; PART_TYPE: INDUCTOR\POWER; CLASS: DISCRETE; CAD_APPROVED: Yes; Temp_Range: -40¡ãC to +125¡ãC; MFG_PN01: WPN252012ER47MT; MFG_NAME01: SHENZHEN SUNLORD ELECTRONICS CO., LTD; AGILE_PN: 180-78647; HEIGHT: 1.2MM; ROHS: Yes; TOL: 20%; Tolerance: 20%; PCB Footprint: ind_sph2520; Temp Range: -40¡ãC to +125¡ãC
L13 = INDUCTOR: IND WW 0.47uH@1MHz 3.4A 20% 2016; CLASS: DISCRETE; AGILE_PN: 180-78630; MFG_NAME01: MURATA; MFG_PN01: 1286AS-H-R47M=P2; Temp_Range: -40C to +85C; CAD_APPROVED: Yes; PCB Footprint: IND_2016A; VOLTAGE: 20V DC; Tolerance: 20%; ROHS: Yes; HEIGHT: 1.2MM; PART_TYPE: INDUCTOR; Temp Range: -40C to +85C
QZ2 = XTAL: XTAL 32.768KHZ 12.5PF 20PPM 3.2X1.5MM SMT; CLASS: IC; CAD_APPROVED: Yes; MFG_PN01: ABS07-32.768KHZ-T; MFG_NAME01: Abracon Corporation; AGILE_PN: 230-77653; PCB Footprint: XTAL2-3P2X1P5-SM; HEIGHT: 0.9MM; ROHS: Yes
R48 R54 R55 R194 R202 = RES: RES MF ZERO OHM 1/16W 5% 0402; CLASS: DISCRETE; FPLIST: RC0402_25,RC0402_HD,RC0402_X2,0402_CC; CAD_APPROVED: Yes; MFG_PN01: RC0402JR-070RL; MFG_NAME01: YAGEO AMERICA; AGILE_PN: 470-75394; PCB Footprint: 0402_CC; HEIGHT: 0.45 MM; ROHS: Yes; Tolerance: 5%; VOLTAGE: 1/16W
R51 = RES: RES MF ZERO OHM 1/16W 5% 0402; CLASS: DISCRETE; CAD_APPROVED: Yes; MFG_PN01: RC0402JR-070RL; MFG_NAME01: YAGEO AMERICA; AGILE_PN: 470-75394; PCB Footprint: 0402_CC; HEIGHT: 0.45 MM; ROHS: Yes; Tolerance: 5%; VOLTAGE: 1/16W
R52 R127 R193 R195 R203 R224 = RES: RES MF ZERO OHM 1/16W 5% 0402; CLASS: DISCRETE; AGILE_PN: 470-75394; MFG_NAME01: YAGEO AMERICA; MFG_PN01: RC0402JR-070RL; CAD_APPROVED: Yes; FPLIST: RC0402_25,RC0402_HD,RC0402_X2,0402_CC; PCB Footprint: 0402_CC; Tolerance: 5%; ROHS: Yes; HEIGHT: 0.45 MM; VOLTAGE: 1/16W
R61 = RES: RES MF 100K 1/20W 1% 0201; CLASS: DISCRETE; AGILE_PN: 470-77704; MFG_NAME01: SKYMOS; MFG_PN01: RC-0201-104FT; CAD_APPROVED: Yes; FPLIST: RC0201,0201_CC; PCB Footprint: 0201_CC; Tolerance: 1%; ROHS: Yes; HEIGHT: 0.26MM
R106 = RES: RES MF 100K 1/20W 1% 0201; CLASS: DISCRETE; FPLIST: RC0201,0201_CC; CAD_APPROVED: Yes; MFG_PN01: RC-0201-104FT; MFG_NAME01: SKYMOS; AGILE_PN: 470-77704; PCB Footprint: 0201_CC; HEIGHT: 0.26MM; ROHS: Yes; Tolerance: 1%
R111 = RES: RES MF ZERO OHM 1/16W 5% 0402; CLASS: DISCRETE; AGILE_PN: 470-75394; MFG_NAME01: YAGEO AMERICA; MFG_PN01: RC0402JR-070RL; CAD_APPROVED: Yes; TOL: 1%; SIGNAL_MODEL: DEFAULT_RESISTOR_10000OHM_2_1; PCB Footprint: 0402_CC; Tolerance: 5%; ROHS: Yes; HEIGHT: 0.45 MM; VOLTAGE: 1/16W
R114 R137 = RES: RES MF ZERO OHM 1/16W 5% 0402; CLASS: DISCRETE; AGILE_PN: 470-75394; MFG_NAME01: YAGEO AMERICA; MFG_PN01: RC0402JR-070RL; CAD_APPROVED: Yes; PCB Footprint: 0402_CC; Tolerance: 5%; ROHS: Yes; HEIGHT: 0.45 MM; VOLTAGE: 1/16W
R191 R192 R198 R199 = RES: RES MF ZERO OHM 1/16W 5% 0402; CLASS: DISCRETE; PCB Footprint: 0402_CC; FPLIST: RC0402_25,RC0402_HD,RC0402_X2,0402_CC; CAD_APPROVED: Yes; MFG_PN01: RC0402JR-070RL; MFG_NAME01: YAGEO AMERICA; AGILE_PN: 470-75394; HEIGHT: 0.45 MM; ROHS: Yes; Tolerance: 5%; VOLTAGE: 1/16W
R196 R197 R201 = RES: RES MF 4.7K 1/20W 5% AEC-Q200 0201; CLASS: DISCRETE; PCB Footprint: 0201_CC; FPLIST: RC0201,0201_CC; CAD_APPROVED: Yes; Temp_Range: -55C to +155C; MFG_PN01: RK73B1HTTC472J; MFG_NAME01: KOA SPEER; AGILE_PN: 470-79700; HEIGHT: 0.25MM; ROHS: Yes; Tolerance: 5%; Temp Range: -55C to +155C
R200 = RES: RES MF 4.7K 1/20W 5% AEC-Q200 0201; CLASS: DISCRETE; PCB Footprint: 0201_CC; AGILE_PN: 470-79700; MFG_NAME01: KOA SPEER; MFG_PN01: RK73B1HTTC472J; Temp_Range: -55C to +155C; CAD_APPROVED: Yes; FPLIST: RC0201,0201_CC; Tolerance: 5%; ROHS: Yes; HEIGHT: 0.25MM; Temp Range: -55C to +155C
TP22 TP23 TP28 TP29 TP31-TP33 TP53 = T POINT R: TEST POINT PAD .035 SMT, no part to order; ASSY_OPT: DNP; CLASS: IC; AGILE_PN: 510-75618; CAD_APPROVED: Yes; PCB Footprint: testpoint_35mil; ROHS: Yes; HEIGHT: 0.1MM
TP25-TP27 TP68 = T POINT R: TEST POINT PAD .035 SMT, no part to order; ASSY_OPT: DNP; CLASS: IC; CAD_APPROVED: Yes; AGILE_PN: 510-75618; PCB Footprint: testpoint_35mil; HEIGHT: 0.1MM; ROHS: Yes
TP44 TP45 TP47 = TESTLOOP: TEST POINT PAD 50MIL DIA SMT, NO PART TO ORDER; ASSY_OPT: DNP; CLASS: IO; CAD_APPROVED: Yes; MFG_PN01: NOTACOMPONENT; AGILE_PN: 211-76644; PCB Footprint: TPAD_050; HEIGHT: 0.1MM; ROHS: Yes; MFG_NAME01: NOTACOMPONENT
TP46 = TESTLOOP: TEST POINT PAD 50MIL DIA SMT, NO PART TO ORDER; ASSY_OPT: DNP; CLASS: IO; AGILE_PN: 211-76644; MFG_NAME01: NOTACOMPONENT; CAD_APPROVED: Yes; PCB Footprint: TPAD_050; MFG_PN01: NOTACOMPONENT; ROHS: Yes; HEIGHT: 0.1MM
U8 = PCA9450_HVQFN56P_A: IC POWER MANAGEMENT 2.7-5.5V HVQFN56; SPLIT_INST: TRUE; SWAP_INFO: (S1+S2+S3); AGILE_PN: TMP-WF-36197; MFG_NAME01: NXP SEMICONDUCTORS; Temp_Range: -40C to +105C; PRE_APN: 315-82314; CAD_APPROVED: Yes; PCB Footprint: hvqfn56_0p4_7x7_ep4p7mm; CLASS: IC; MFG_PN01: PCA9450BHN; ROHS: Yes; HEIGHT: 1MM; VOLTAGE: 2.7-5.5V; Temp Range: -40C to +105C

## Sheet Page12 SOM Interface.SchDoc
size 411 x 246 mm; SheetNumber: 10; SheetTotal: 11
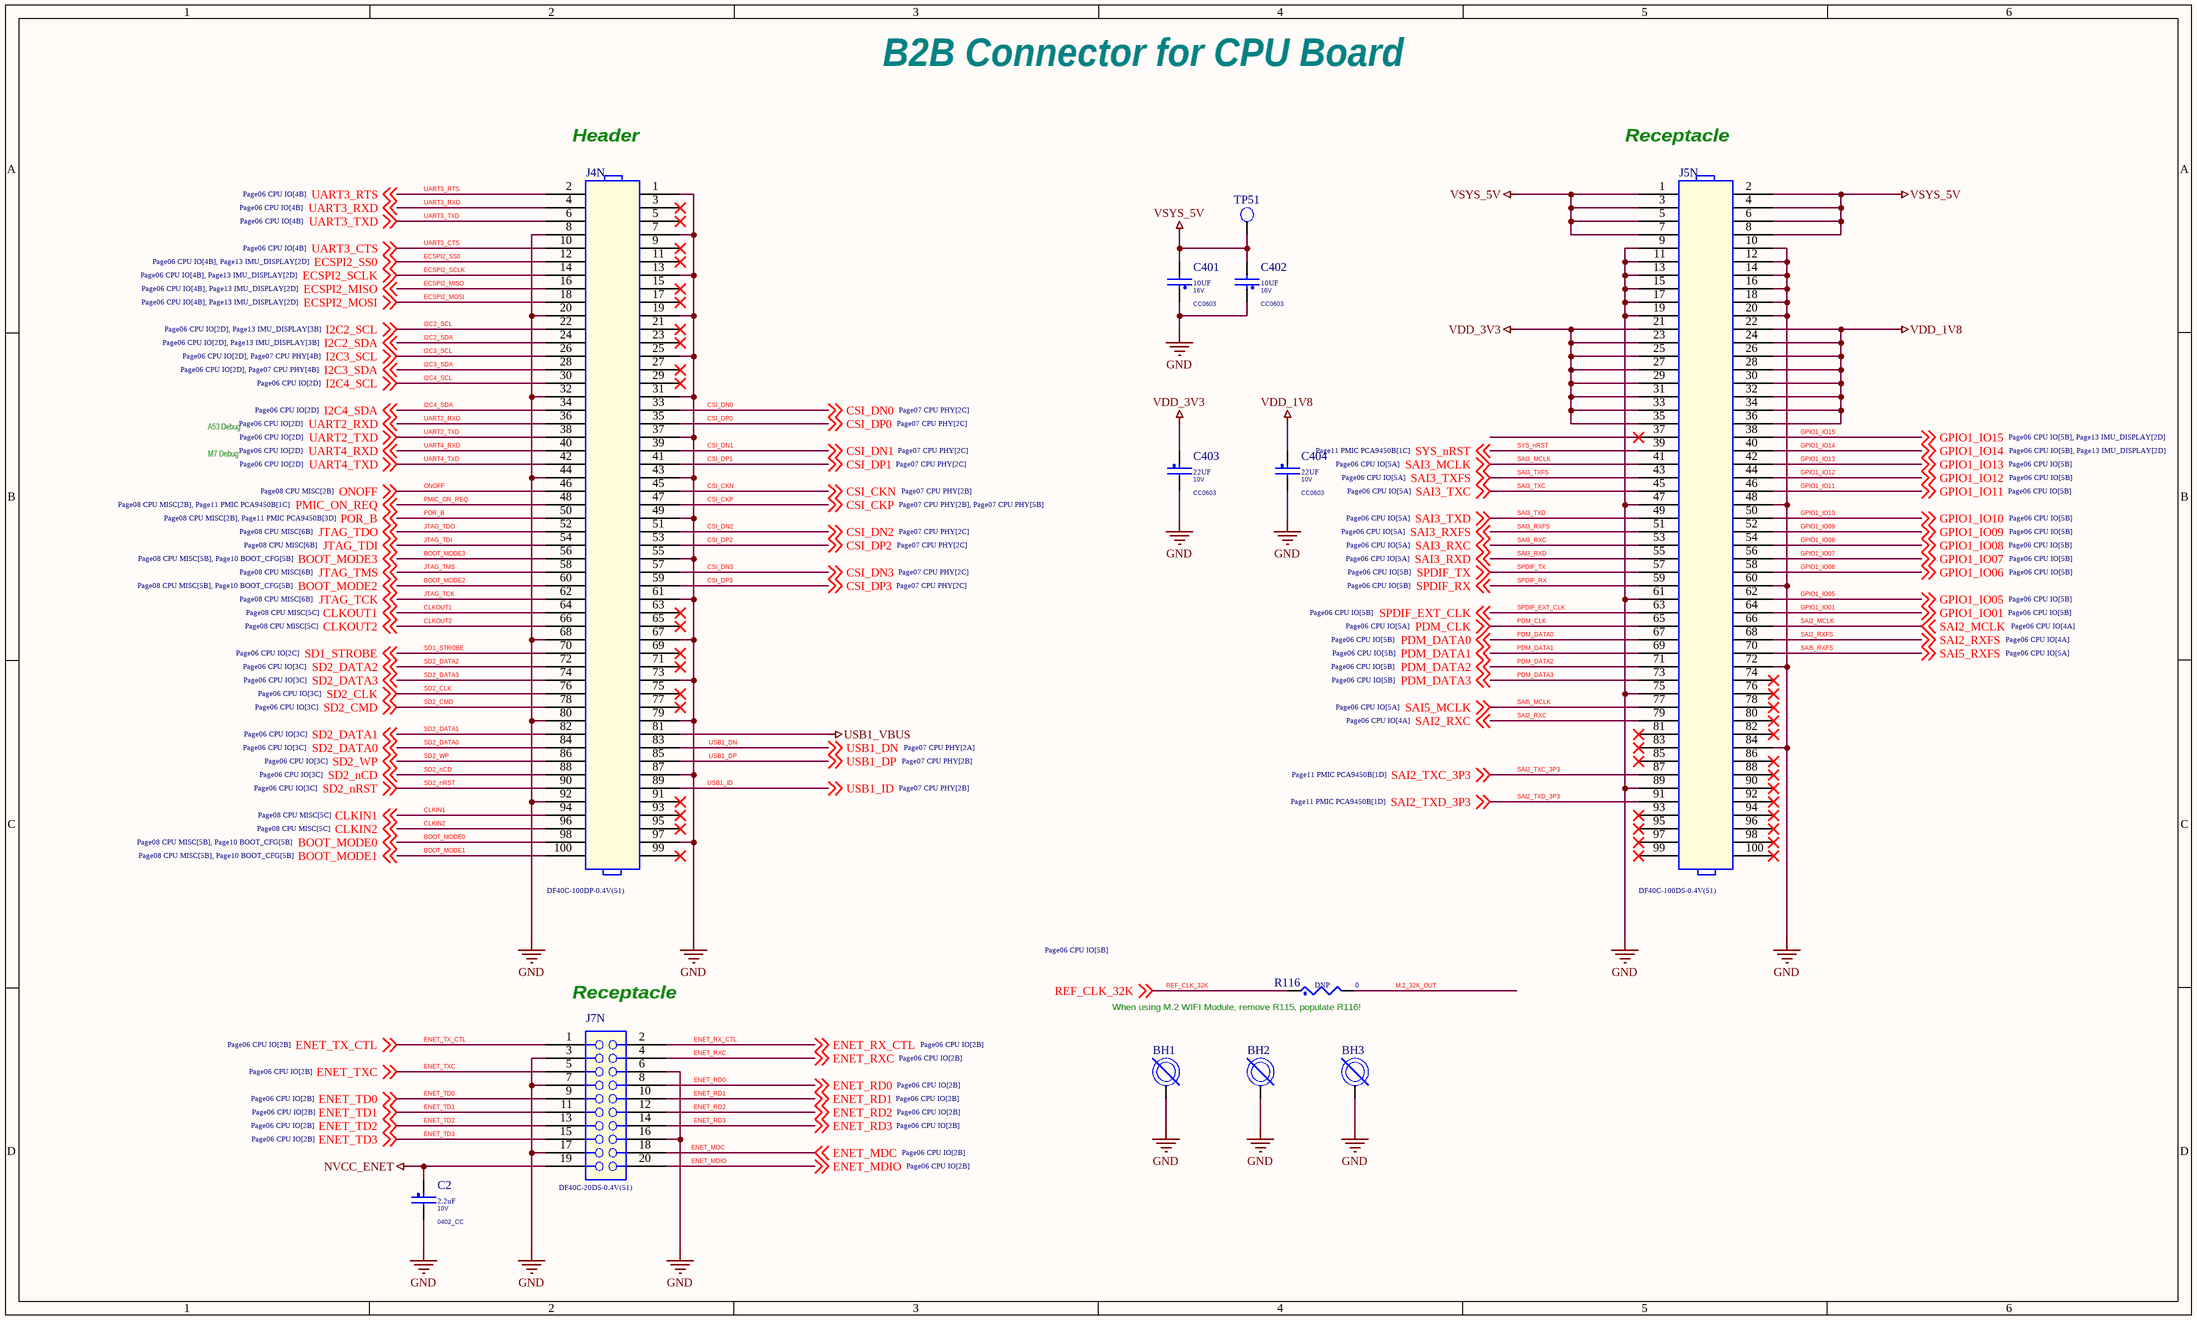
[diagram p11: Page12 SOM Interface.SchDoc]

### Parts
BH1  MOUNTING HOLE  [GNDPOINT256]  (value not drawn)
BH2  MOUNTING HOLE  [GNDPOINT256]  (value not drawn)
BH3  MOUNTING HOLE  [GNDPOINT256]  (value not drawn)
C2  2.2uF  VOLTAGE: 10V  [0402_CC]
C401  10UF  PCB Footprint: CC0603  VOLTAGE: 16V  [0603_CC]
C402  10UF  PCB Footprint: CC0603  VOLTAGE: 16V  [0603_CC]
C403  22UF  PCB Footprint: CC0603  VOLTAGE: 10V  [0603_CC]
C404  22UF  PCB Footprint: CC0603  VOLTAGE: 10V  [0603_CC]
J4N  DF40C-100DP-0.4V(51)  [con100_0p4_21p7x2p05_sm]
J5N  DF40C-100DS-0.4V(51)  [con100_0p4_22p8x3p1_sm]
J7N  DF40C-20DS-0.4V(51)  [con20_0p4_6p8x3p1_sm]
R116  0  ASSY_OPT: DNP  [0402_CC_RES]
TP51  TP_35MIL  [Test Pin]  (value not drawn)

### Nets
GND: BH1.1 BH2.1 BH3.1 C2.2 C401.1 C402.1 C403.2 C404.2 J4N.1 J4N.7 J4N.8 J4N.13 J4N.19 J4N.20 J4N.25 J4N.31 J4N.32 J4N.37 J4N.43 J4N.44 J4N.49 J4N.55 J4N.61 J4N.67 J4N.68 J4N.73 J4N.79 J4N.80 J4N.87 J4N.92 J4N.97 J5N.9 J5N.10 J5N.11 J5N.12 J5N.13 J5N.14 J5N.15 J5N.16 J5N.17 J5N.18 J5N.19 J5N.20 J5N.47 J5N.48 J5N.60 J5N.61 J5N.72 J5N.75 J5N.84 J5N.89 J7N.3 J7N.6 J7N.7 J7N.16 J7N.17
NVCC_ENET: C2.1 J7N.19
USB1_VBUS: J4N.81
VDD_1V8: C404.1 J5N.22 J5N.24 J5N.26 J5N.28 J5N.30 J5N.32 J5N.34 J5N.36
VDD_3V3: C403.1 J5N.21 J5N.23 J5N.25 J5N.27 J5N.29 J5N.31 J5N.33 J5N.35
VSYS_5V: C401.2 C402.2 J5N.1 J5N.2 J5N.3 J5N.4 J5N.5 J5N.6 J5N.7 J5N.8 TP51.1(TP)
BOOT_MODE0: J4N.98 ; off-sheet BOOT_MODE0
BOOT_MODE1: J4N.100 ; off-sheet BOOT_MODE1
BOOT_MODE2: J4N.60 ; off-sheet BOOT_MODE2
BOOT_MODE3: J4N.56 ; off-sheet BOOT_MODE3
CLKIN1: J4N.94 ; off-sheet CLKIN1
CLKIN2: J4N.96 ; off-sheet CLKIN2
CLKOUT1: J4N.64 ; off-sheet CLKOUT1
CLKOUT2: J4N.66 ; off-sheet CLKOUT2
CSI_CKN: J4N.45 ; off-sheet CSI_CKN
CSI_CKP: J4N.47 ; off-sheet CSI_CKP
CSI_DN0: J4N.33 ; off-sheet CSI_DN0
CSI_DN1: J4N.39 ; off-sheet CSI_DN1
CSI_DN2: J4N.51 ; off-sheet CSI_DN2
CSI_DN3: J4N.57 ; off-sheet CSI_DN3
CSI_DP0: J4N.35 ; off-sheet CSI_DP0
CSI_DP1: J4N.41 ; off-sheet CSI_DP1
CSI_DP2: J4N.53 ; off-sheet CSI_DP2
CSI_DP3: J4N.59 ; off-sheet CSI_DP3
ECSPI2_MISO: J4N.16 ; off-sheet ECSPI2_MISO
ECSPI2_MOSI: J4N.18 ; off-sheet ECSPI2_MOSI
ECSPI2_SCLK: J4N.14 ; off-sheet ECSPI2_SCLK
ECSPI2_SS0: J4N.12 ; off-sheet ECSPI2_SS0
ENET_MDC: J7N.18 ; off-sheet ENET_MDC
ENET_MDIO: J7N.20 ; off-sheet ENET_MDIO
ENET_RD0: J7N.8 ; off-sheet ENET_RD0
ENET_RD1: J7N.10 ; off-sheet ENET_RD1
ENET_RD2: J7N.12 ; off-sheet ENET_RD2
ENET_RD3: J7N.14 ; off-sheet ENET_RD3
ENET_RX_CTL: J7N.2 ; off-sheet ENET_RX_CTL
ENET_RXC: J7N.4 ; off-sheet ENET_RXC
ENET_TD0: J7N.9 ; off-sheet ENET_TD0
ENET_TD1: J7N.11 ; off-sheet ENET_TD1
ENET_TD2: J7N.13 ; off-sheet ENET_TD2
ENET_TD3: J7N.15 ; off-sheet ENET_TD3
ENET_TX_CTL: J7N.1 ; off-sheet ENET_TX_CTL
ENET_TXC: J7N.5 ; off-sheet ENET_TXC
GPIO1_IO01: J5N.64 ; off-sheet GPIO1_IO01
GPIO1_IO05: J5N.62 ; off-sheet GPIO1_IO05
GPIO1_IO06: J5N.58 ; off-sheet GPIO1_IO06
GPIO1_IO07: J5N.56 ; off-sheet GPIO1_IO07
GPIO1_IO08: J5N.54 ; off-sheet GPIO1_IO08
GPIO1_IO09: J5N.52 ; off-sheet GPIO1_IO09
GPIO1_IO10: J5N.50 ; off-sheet GPIO1_IO10
GPIO1_IO11: J5N.46 ; off-sheet GPIO1_IO11
GPIO1_IO12: J5N.44 ; off-sheet GPIO1_IO12
GPIO1_IO13: J5N.42 ; off-sheet GPIO1_IO13
GPIO1_IO14: J5N.40 ; off-sheet GPIO1_IO14
GPIO1_IO15: J5N.38 ; off-sheet GPIO1_IO15
I2C2_SCL: J4N.22 ; off-sheet I2C2_SCL
I2C2_SDA: J4N.24 ; off-sheet I2C2_SDA
I2C3_SCL: J4N.26 ; off-sheet I2C3_SCL
I2C3_SDA: J4N.28 ; off-sheet I2C3_SDA
I2C4_SCL: J4N.30 ; off-sheet I2C4_SCL
I2C4_SDA: J4N.34 ; off-sheet I2C4_SDA
JTAG_TCK: J4N.62 ; off-sheet JTAG_TCK
JTAG_TDI: J4N.54 ; off-sheet JTAG_TDI
JTAG_TDO: J4N.52 ; off-sheet JTAG_TDO
JTAG_TMS: J4N.58 ; off-sheet JTAG_TMS
M.2_32K_OUT: R116.2
ONOFF: J4N.46 ; off-sheet ONOFF
PDM_CLK: J5N.65 ; off-sheet PDM_CLK
PDM_DATA0: J5N.67 ; off-sheet PDM_DATA0
PDM_DATA1: J5N.69 ; off-sheet PDM_DATA1
PDM_DATA2: J5N.71 ; off-sheet PDM_DATA2
PDM_DATA3: J5N.73 ; off-sheet PDM_DATA3
PMIC_ON_REQ: J4N.48 ; off-sheet PMIC_ON_REQ
POR_B: J4N.50 ; off-sheet POR_B
REF_CLK_32K: R116.1 ; off-sheet REF_CLK_32K
SAI2_MCLK: J5N.66 ; off-sheet SAI2_MCLK
SAI2_RXC: J5N.79 ; off-sheet SAI2_RXC
SAI2_RXFS: J5N.68 ; off-sheet SAI2_RXFS
SAI2_TXC_3P3: J5N.87 ; off-sheet SAI2_TXC_3P3
SAI2_TXD_3P3: J5N.91 ; off-sheet SAI2_TXD_3P3
SAI3_MCLK: J5N.41 ; off-sheet SAI3_MCLK
SAI3_RXC: J5N.53 ; off-sheet SAI3_RXC
SAI3_RXD: J5N.55 ; off-sheet SAI3_RXD
SAI3_RXFS: J5N.51 ; off-sheet SAI3_RXFS
SAI3_TXC: J5N.45 ; off-sheet SAI3_TXC
SAI3_TXD: J5N.49 ; off-sheet SAI3_TXD
SAI3_TXFS: J5N.43 ; off-sheet SAI3_TXFS
SAI5_MCLK: J5N.77 ; off-sheet SAI5_MCLK
SAI5_RXFS: J5N.70 ; off-sheet SAI5_RXFS
SD1_STROBE: J4N.70 ; off-sheet SD1_STROBE
SD2_CLK: J4N.76 ; off-sheet SD2_CLK
SD2_CMD: J4N.78 ; off-sheet SD2_CMD
SD2_DATA0: J4N.84 ; off-sheet SD2_DATA0
SD2_DATA1: J4N.82 ; off-sheet SD2_DATA1
SD2_DATA2: J4N.72 ; off-sheet SD2_DATA2
SD2_DATA3: J4N.74 ; off-sheet SD2_DATA3
SD2_nCD: J4N.88 ; off-sheet SD2_nCD
SD2_nRST: J4N.90 ; off-sheet SD2_nRST
SD2_WP: J4N.86 ; off-sheet SD2_WP
SPDIF_EXT_CLK: J5N.63 ; off-sheet SPDIF_EXT_CLK
SPDIF_RX: J5N.59 ; off-sheet SPDIF_RX
SPDIF_TX: J5N.57 ; off-sheet SPDIF_TX
SYS_nRST: J5N.39 ; off-sheet SYS_nRST
UART2_RXD: J4N.36 ; off-sheet UART2_RXD
UART2_TXD: J4N.38 ; off-sheet UART2_TXD
UART3_CTS: J4N.10 ; off-sheet UART3_CTS
UART3_RTS: J4N.2 ; off-sheet UART3_RTS
UART3_RXD: J4N.4 ; off-sheet UART3_RXD
UART3_TXD: J4N.6 ; off-sheet UART3_TXD
UART4_RXD: J4N.40 ; off-sheet UART4_RXD
UART4_TXD: J4N.42 ; off-sheet UART4_TXD
USB1_DN: J4N.83 ; off-sheet USB1_DN
USB1_DP: J4N.85 ; off-sheet USB1_DP
USB1_ID: J4N.89 ; off-sheet USB1_ID

Not connected (* = marked no-connect by the designer): J4N 3* 5* 9* 11* 15* 17* 21* 23* 27* 29* 63* 65* 69* 71* 75* 77* 91* 93* 95* 99*; J5N 37* 74* 76* 78* 80* 81* 82* 83* 85* 86* 88* 90* 92* 93* 94* 95* 96* 97* 98* 99* 100*

### Notes on the sheet
- B2B Connector for CPU Board
- (near J4N) Header
- (near J5N) Receptacle
- A53 Debug
- M7 Debug
- (near J7N) Receptacle
- (near R116) When using M.2 WIFI Module, remove R115, populate R116!

### Library data of the parts
BH1 = MOUNT_HOLE: MOUNTING HOLE DRILL 109 PAD 200 PLATED TH NO PART TO ORDER; CLASS: IC; CAD_APPROVED: Yes; ASSY_OPT: DNP; AGILE_PN: 280-75147; HEIGHT: 0.005 MILS; ROHS: Yes; PCB Footprint: GNDPOINT256
BH2 BH3 = MOUNT_HOLE: MOUNTING HOLE DRILL 109 PAD 200 PLATED TH NO PART TO ORDER; CLASS: IC; AGILE_PN: 280-75147; ASSY_OPT: DNP; CAD_APPROVED: Yes; ROHS: Yes; HEIGHT: 0.005 MILS; PCB Footprint: GNDPOINT256
C2 = CAP_NP: as C363 on sheet Page11 PMIC PCA9450B; Package Size: 0402; Tolerance: 10%; ROHS: Yes; HEIGHT: 0.55 MM; PCB Footprint: 0402_CC
C401 = CAP_NP: CAP CER 10.0uF 16V 10% X5R 0603; CLASS: DISCRETE; Temp Range: -55¡ãC to +85¡ãC; AGILE_PN: 150-80060; MFG_NAME01: MURATA; MFG_PN01: GRM188R61C106KAALD; CAD_APPROVED: Yes; FPLIST: CC0603_OV,CC0603,0603_CC,cc0603_0805_nsp; Package Type: SMT; Package Size: 0603; Tolerance: 10%; ROHS: Yes; Temp_Range: -55¡ãC to +85¡ãC; HEIGHT: 0.9MM
C402 = CAP_NP: CAP CER 10.0uF 16V 10% X5R 0603; CLASS: DISCRETE; Temp Range: -55¡ãC to +85¡ãC; FPLIST: CC0603_OV,CC0603,0603_CC,cc0603_0805_nsp; CAD_APPROVED: Yes; MFG_PN01: GRM188R61C106KAALD; MFG_NAME01: MURATA; AGILE_PN: 150-80060; Package Type: SMT; Package Size: 0603; HEIGHT: 0.9MM; Temp_Range: -55¡ãC to +85¡ãC; ROHS: Yes; Tolerance: 10%
C403 C404 = CAP_NP: as C283 on sheet Page11 PMIC PCA9450B; Package Size: 0603; Tolerance: 20%; ROHS: Yes; HEIGHT: 1MM
J4N = HDR_2X50_M: CON 2X50 PLUG SHRD SMT 0.4MM SP 51H AU; CLASS: IO; Temp Range: -35 to 85 &#8451;; CAD_APPROVED: Yes; MFG_NAME01: HIROSE; AGILE_PN: 211-80305; HEIGHT: 1.29MM; Temp_Range: -35 to 85 &#8451;; ROHS: Yes; MFG_PN01: DF40C-100DP-0.4V(51); PCB Footprint: con100_0p4_21p7x2p05_sm
J5N = HDR_2X50_M: CON 2X50 SKT SHRD SMT 0.4MM SP 65H AU; CLASS: IO; Temp Range: -35C to +85C; AGILE_PN: 211-80183; MFG_NAME01: HIROSE; CAD_APPROVED: Yes; Package Type: SMT; MFG_PN01: DF40C-100DS-0.4V(51); ROHS: Yes; Temp_Range: -35C to +85C; HEIGHT: 1.65 MM; PCB Footprint: con100_0p4_22p8x3p1_sm
J7N = CONN_HDR_10X2: CON 2X10 SKT SHRD SMT 0.4MM SP 63H AU; CLASS: IO; Temp Range: -35C to 85C; CAD_APPROVED: Yes; MFG_NAME01: HIROSE; AGILE_PN: 211-80328; PCB Footprint: con20_0p4_6p8x3p1_sm; HEIGHT: 1.6MM; Temp_Range: -35C to 85C; ROHS: Yes; MFG_PN01: DF40C-20DS-0.4V(51)
R116 = RES: as R114 on sheet Page11 PMIC PCA9450B; VOLTAGE: 1/16W; Tolerance: 5%; ROHS: Yes; HEIGHT: 0.45 MM
TP51 = T POINT R: TEST POINT PAD .035 SMT, no part to order; ASSY_OPT: DNP; CLASS: IC; PCB Footprint: testpoint_35mil; AGILE_PN: 510-75618; CAD_APPROVED: Yes; ROHS: Yes; HEIGHT: 0.1MM

## Sheet Page13 IMU_DISPLAY.SchDoc
size A3; SheetNumber: 13; SheetTotal: 13
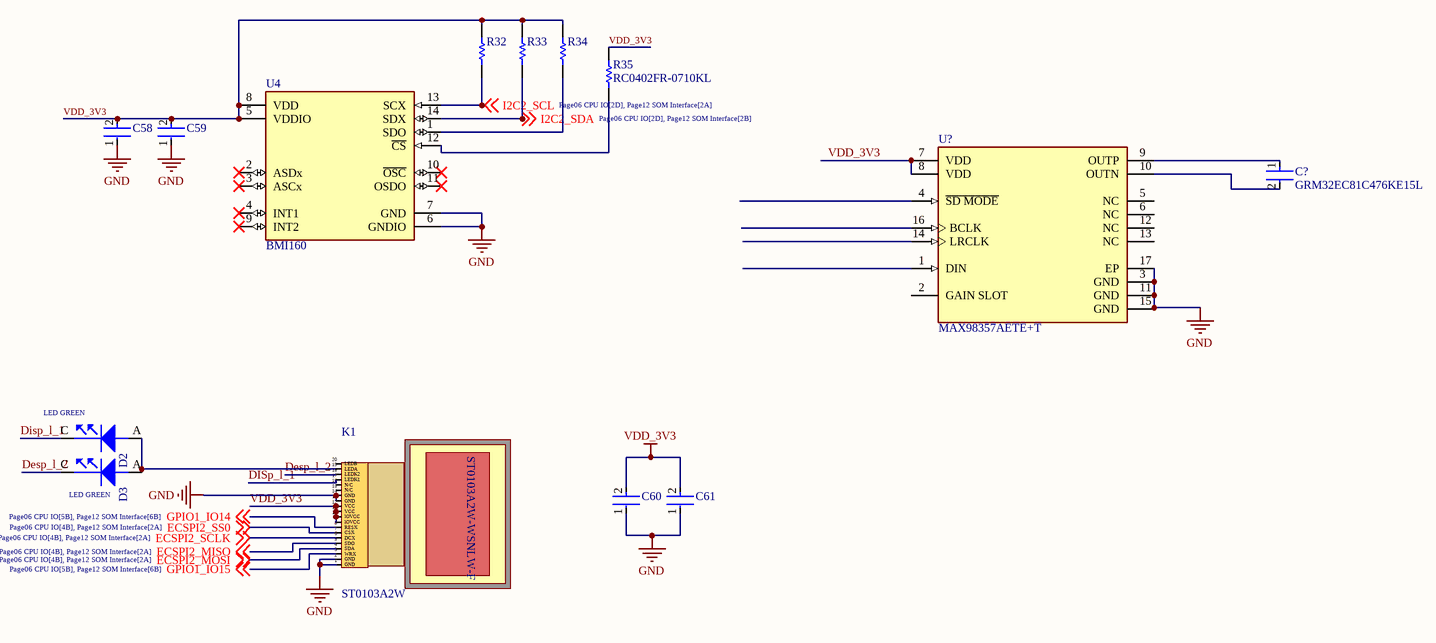
[diagram p12: Page13 IMU_DISPLAY.SchDoc]

### Parts
C58  GRM155R71C104KA88D  [FP-GRM15-MFG]  (value not drawn)
C59  GRM155R71C104KA88D  [FP-GRM15-MFG]  (value not drawn)
C60  GRM155R71C104KA88D  [FP-GRM15-MFG]  (value not drawn)
C61  GRM155R71C104KA88D  [FP-GRM15-MFG]  (value not drawn)
C?  GRM32EC81C476KE15L  [FP-GRM32E-0_3-0_2-IPC_A]
D2  LED GREEN  [LED_0603]
D3  LED GREEN  [LED_0603]
K1  ST0103A2W  [DPAK70P1823X500-20N]
R32  RC0402FR-0710KL  [RESC1005X40X25LL05T10]  (value not drawn)
R33  RC0402FR-0710KL  [RESC1005X40X25LL05T10]  (value not drawn)
R34  RC0402FR-0710KL  [RESC1005X40X25LL05T10]  (value not drawn)
R35  RC0402FR-0710KL  [RESC1005X40X25LL05T10]
U4  BMI160  [FP-BMI160-MFG]
U?  MAX98357AETE+T  [FP-T1633-4-MFG]

### Nets
GND: C58.1 C59.1 C60.1 C61.1 K1.1(GND) K1.2(GND) K1.13(GND) K1.14(GND) U4.6(GNDIO) U4.7(GND) U?.3(GND) U?.11(GND) U?.15(GND) U?.17(EP)
VDD_3V3: C58.2 C59.2 C60.2 C61.2 K1.9(lOVCC) K1.10(lOVCC) K1.11(VCC) K1.12(VCC) R32.2 R33.2 R34.2 R35.2 U4.5(VDDIO) U4.8(VDD) U?.7(VDD) U?.8(VDD)
Desp_l_2: D3.C(CATHODE) K1.18(LEDK2)
Disp_l_1: D2.C(CATHODE) K1.17(LEDK1)
ECSPI2_MISO: K1.5(SDO) ; off-sheet ECSPI2_MISO
ECSPI2_MOSI: K1.4(SDA) ; off-sheet ECSPI2_MOSI
ECSPI2_SCLK: K1.6(DCX) ; off-sheet ECSPI2_SCLK
ECSPI2_SS0: K1.7(CSX) ; off-sheet ECSPI2_SS0
GPIO1_IO14: K1.8(RESX) ; off-sheet GPIO1_IO14
GPIO1_IO15: K1.3(WRX) ; off-sheet GPIO1_IO15
I2C2_SCL: R32.1 U4.13(SCX) ; off-sheet I2C2_SCL
I2C2_SDA: R33.1 U4.14(SDX) ; off-sheet I2C2_SDA
NetC?_1: C?.1 U?.9(OUTP)
NetC?_2: C?.2 U?.10(OUTN)
NetD2_A: D2.A(ANODE) D3.A(ANODE) K1.19(LEDA)
NetR34_1: R34.1 U4.1(SDO)
NetR35_1: R35.1 U4.12(~{CS})

Not connected (* = marked no-connect by the designer): K1 15(N/C) 16(N/C) 20(LEDB); U4 2(ASDx)* 3(ASCx)* 4(INT1)* 9(INT2)* 10(~{OSC})* 11(OSDO)*; U? 1(DIN) 2(GAIN_SLOT) 4(~{SD_MODE}) 5(NC) 6(NC) 12(NC) 13(NC) 14(LRCLK) 16(BCLK)

### Notes on the sheet
- (in symbol ST0103A2W) ST0103A2W-WSNLW-F

### Library data of the parts
C58-C61 = CMP-2100-03641-2: CAP CER 0.1UF 16V X7R 0402; Manufacturer: Murata; Standoff Height: 0mm; Tolerance: 10%; Voltage Rating: 16Vdc; Material: Ceramic; Capacitance: 0.10μF; Value: 0.10μF; RoHS: TRUE; Manufacturer Part Number: GRM155R71C104KA88D; Temperature Characteristic: X7R; Octopart: https://octopart.com/grm155r71c104ka88d-murata-196880; Digikey Description: CAP CER 0.1UF 16V X7R 0402; Device Class L3: Ceramic Capacitors; Height: 0.55mm; ComponentLink2Description: Datasheet; Temperature Range Low: -55°C; Ipc Land Pattern Name: CAPC10050X219; ComponentLink2URL: https://search.murata.co.jp/Ceramy/image/img/A01X/G101/ENG/GRM155R71H471KA01-01A.pdf; Device Class L1: Passive Components; Lead Free: yes; Category: Cap; Package: GRM15; Temperature: -55°C to +125°C; Device Class L2: Capacitors; Temperature Range High: +125°C; Mouser Description: 0402 0.1 uF 16V ±10 % Tolerance X7R SMT Multilayer Ceramic Capacitor
C? = CMP-06035-000110-2: Chip Multilayer Ceramic Capacitors for General Purpose, 1210, 47uF, X6S, 22%, 10%, 16V; Case Code (Metric): 3225; Packaging: Tape and Reel; Mount: Surface Mount; Material: Ceramic; Voltage: 16V; Dielectric: X6S; Depth: 2.5mm; Min Operating Temperature: -55°C; Width: 2.5mm; Height: 2.5mm; Voltage Rating: 16V; Weight: 0.00388oz; Case Code (Imperial): 1210; Max Operating Temperature: 105°C; Capacitance: 47uF; Package Quantity: 1000; Case/Package: 1210; Voltage Rating (DC): 16V; Termination: SMD/SMT; Length: 3.2mm; Thickness: 0.106inch; Tolerance: 10%; Lead Free: Lead Free; REACH SVHC: No SVHC
D2 D3 = LED: LED GRN SGL 25MA SMT 0603; CLASS: IC; VOLTAGE: 2V; AGILE_PN: 370-76672; MFG_NAME01: DIALIGHT; MFG_PN01: 598-8070-107F; CAD_APPROVED: Yes; ROHS: Yes; HEIGHT: 0.8 MM; PCB Footprint: LED_0603
R32-R35 = CMP-2002-07353-1: Manufacturer: Yageo / Phycomp; Part Number: RC0402FR-0710KL
U4 = CMP-2000-07537-3: IMU ACCEL/GYRO I2C/SPI 14LGA; Sensor Type: Accelerometer; Output Type: SPI; Mount: Surface Mount; Max Operating Temperature: 85°C; Case/Package: LGA; Min Operating Temperature: -40°C; Packaging: Cut Tape; Lead Free: Lead Free
U? = CMP-05698-000018-1: IC AMP CLASS D MONO 3.2W 16TQFN; Max Supply Voltage: 5.5V; Max Output Current: 1.6A; Voltage Gain: 15dB; Max Power Dissipation: 1.666W; Min Supply Voltage: 2.5V; Power Supply Rejection Ratio (PSRR): 77dB; Series: -; Contact Plating: Tin; Min Operating Temperature: -40°C; Packaging: Tape and Reel; Max Output Power: 3.2W; Mount: Surface Mount; Number of Pins: 16; RoHS Compliant: Yes; Max Operating Temperature: 85°C; Radiation Hardening: No